# Altium project BW0253.PrjPcb (part 1 of 2)
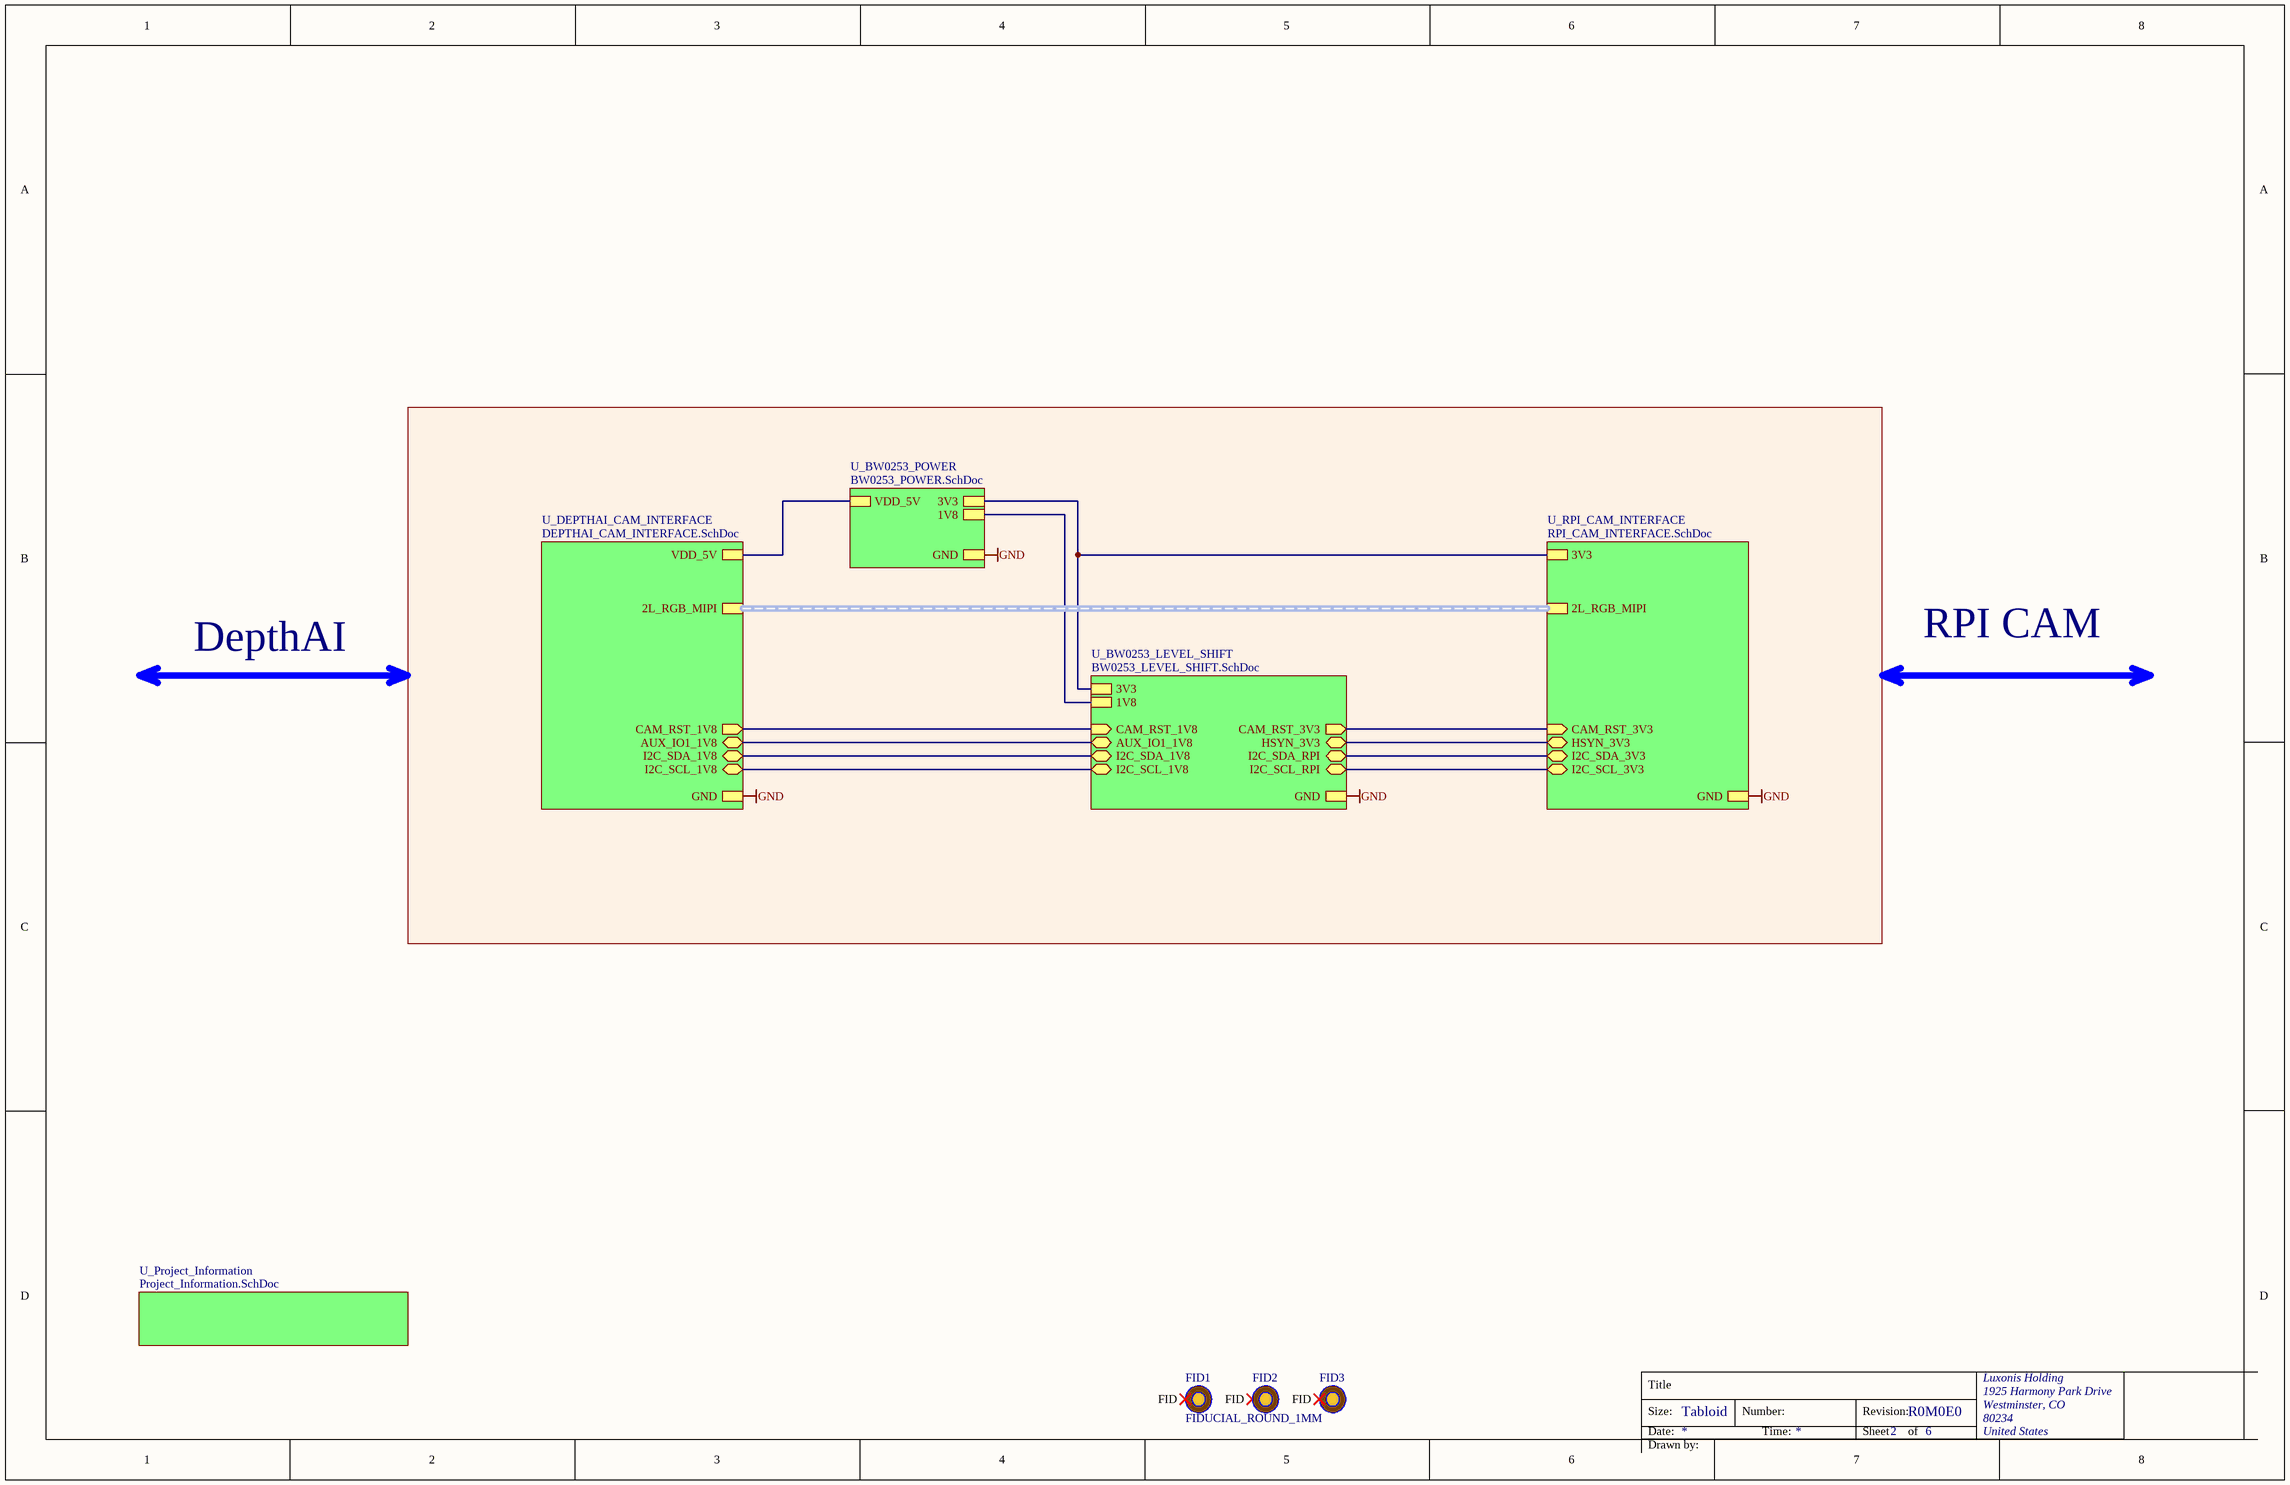
[diagram p0: TopLevel.SchDoc]
document_number: D0000999; drawn_by: Brian Weinstein; project_title: BW0253; revision: R0M0E0
6 sheets, 50 parts. Net scope: hierarchical (ports join the sheet entries above them; power ports are global).
Board file: BW0253.PcbDoc
Sheets:
  TopLevel.SchDoc
    U_Project_Information = Project_Information.SchDoc
    U_BW0253_POWER = BW0253_POWER.SchDoc
    U_BW0253_LEVEL_SHIFT = BW0253_LEVEL_SHIFT.SchDoc
    U_DEPTHAI_CAM_INTERFACE = DEPTHAI_CAM_INTERFACE.SchDoc
    U_RPI_CAM_INTERFACE = RPI_CAM_INTERFACE.SchDoc

## Sheet TopLevel.SchDoc: =project_title
size Tabloid; CompanyName: Luxonis Holding; DrawnBy: Brian Weinstein; Organization: Luxonis Holding; Address1: 1925 Harmony Park Drive; Address2: Westminster, CO; Address3: 80234; Address4: United States; DocumentNumber: D0000999; Revision: R0M0E0; SheetNumber: 2; SheetTotal: 6

### Parts
FID1  FIDUCIAL_ROUND_1MM  [FIDUCIAL_ROUND_1MM]  (no BOM)
FID2  FIDUCIAL_ROUND_1MM  [FIDUCIAL_ROUND_1MM]  (value not drawn)  (no BOM)
FID3  FIDUCIAL_ROUND_1MM  [FIDUCIAL_ROUND_1MM]  (value not drawn)  (no BOM)

### Sub-sheets
U_BW0253_LEVEL_SHIFT = BW0253_LEVEL_SHIFT.SchDoc: GND, 1V8, 3V3, I2C_SCL_RPI (bidir), I2C_SDA_1V8 (bidir), HSYN_3V3 (bidir), I2C_SDA_RPI (bidir), AUX_IO1_1V8 (bidir), CAM_RST_3V3 (out), I2C_SCL_1V8 (bidir), CAM_RST_1V8 (in)
U_BW0253_POWER = BW0253_POWER.SchDoc: 1V8, 3V3, VDD_5V, GND
U_DEPTHAI_CAM_INTERFACE = DEPTHAI_CAM_INTERFACE.SchDoc: 2L_RGB_MIPI (harness 2L_RGB_MIPI), VDD_5V, GND, AUX_IO1_1V8 (bidir), I2C_SDA_1V8 (bidir), CAM_RST_1V8 (out), I2C_SCL_1V8 (bidir)
U_Project_Information = Project_Information.SchDoc: no entries
U_RPI_CAM_INTERFACE = RPI_CAM_INTERFACE.SchDoc: 2L_RGB_MIPI (harness 2L_RGB_MIPI), GND, 3V3, CAM_RST_3V3 (in), HSYN_3V3 (bidir), I2C_SCL_3V3 (bidir), I2C_SDA_3V3 (bidir)

### Nets
1V8: sheet U_BW0253_POWER/1V8, sheet U_BW0253_LEVEL_SHIFT/1V8
3V3: sheet U_BW0253_POWER/3V3, sheet U_BW0253_LEVEL_SHIFT/3V3, sheet U_RPI_CAM_INTERFACE/3V3
GND: sheet U_BW0253_POWER/GND, sheet U_BW0253_LEVEL_SHIFT/GND, sheet U_DEPTHAI_CAM_INTERFACE/GND, sheet U_RPI_CAM_INTERFACE/GND
VDD_5V: sheet U_BW0253_POWER/VDD_5V, sheet U_DEPTHAI_CAM_INTERFACE/VDD_5V
AUX_IO1_1V8: sheet U_BW0253_LEVEL_SHIFT/AUX_IO1_1V8, sheet U_DEPTHAI_CAM_INTERFACE/AUX_IO1_1V8
CAM_RST_1V8: sheet U_BW0253_LEVEL_SHIFT/CAM_RST_1V8, sheet U_DEPTHAI_CAM_INTERFACE/CAM_RST_1V8
CAM_RST_3V3: sheet U_BW0253_LEVEL_SHIFT/CAM_RST_3V3, sheet U_RPI_CAM_INTERFACE/CAM_RST_3V3
HSYN_3V3: sheet U_BW0253_LEVEL_SHIFT/HSYN_3V3, sheet U_RPI_CAM_INTERFACE/HSYN_3V3
I2C_SCL_1V8: sheet U_BW0253_LEVEL_SHIFT/I2C_SCL_1V8, sheet U_DEPTHAI_CAM_INTERFACE/I2C_SCL_1V8
I2C_SCL_3V3: sheet U_BW0253_LEVEL_SHIFT/I2C_SCL_RPI, sheet U_RPI_CAM_INTERFACE/I2C_SCL_3V3
I2C_SDA_1V8: sheet U_BW0253_LEVEL_SHIFT/I2C_SDA_1V8, sheet U_DEPTHAI_CAM_INTERFACE/I2C_SDA_1V8
I2C_SDA_3V3: sheet U_BW0253_LEVEL_SHIFT/I2C_SDA_RPI, sheet U_RPI_CAM_INTERFACE/I2C_SDA_3V3

Not connected (* = marked no-connect by the designer): FID1 FID*; FID2 FID*; FID3 FID*

### Buses and harness runs
harness sheet U_DEPTHAI_CAM_INTERFACE/2L_RGB_MIPI = sheet U_RPI_CAM_INTERFACE/2L_RGB_MIPI

### Notes on the sheet
- DepthAI
- RPI CAM
- Title
- Size:
- Date:
- Tabloid
- Number:
- Time:
- Revision:
- Sheet
- of
- Drawn by:

### Library data of the parts
FID1-FID3 = FIDUCIAL: Fiducial with various available footprints

## Sheet Project_Information.SchDoc: =project_title
size Tabloid; CompanyName: Luxonis Holding; DrawnBy: Brian Weinstein; Organization: Luxonis Holding; Address1: 1925 Harmony Park Drive; Address2: Westminster, CO; Address3: 80234; Address4: United States; DocumentNumber: D0000999; Revision: R0M0E0; SheetNumber: 1; SheetTotal: 6
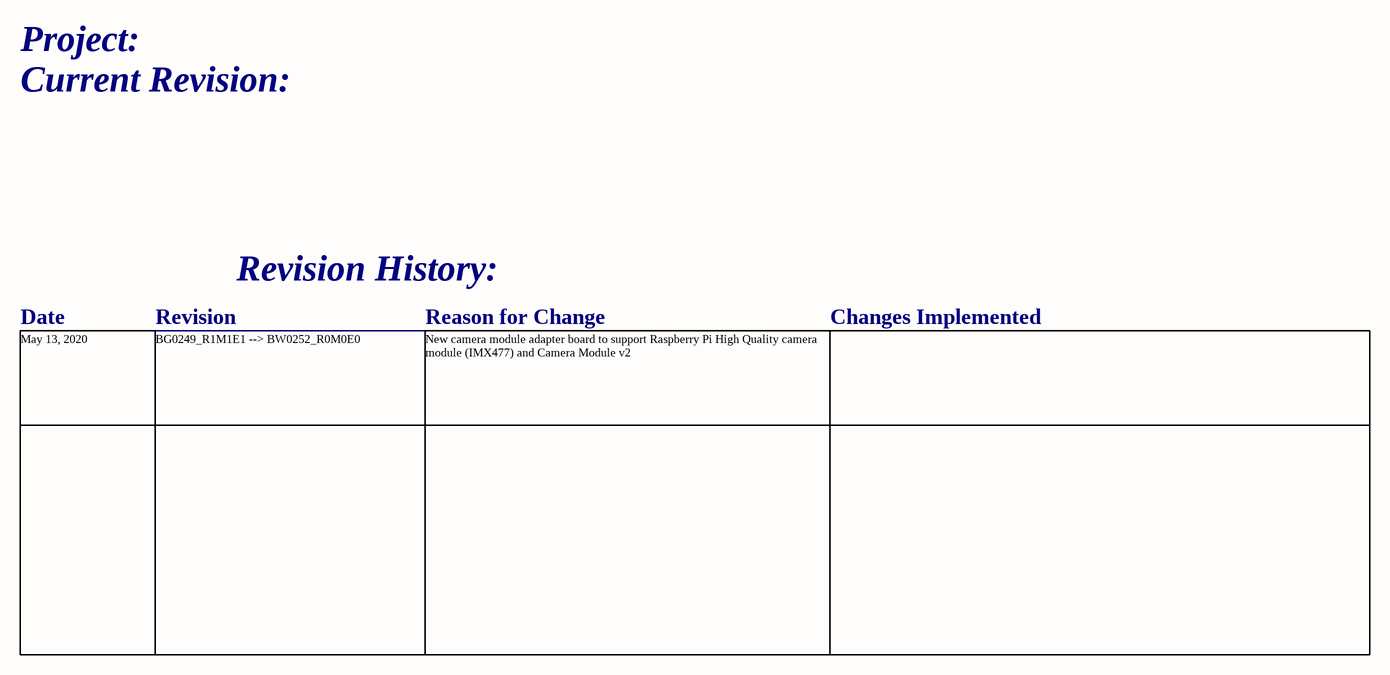
[diagram p1: Project_Information.SchDoc]

### Notes on the sheet
- Project:
- Current Revision:
- Revision History:
- Date
- Revision
- Reason for Change
- Changes Implemented
- May 13, 2020
- BG0249_R1M1E1 --> BW0252_R0M0E0
- New camera module adapter board to support Raspberry Pi High Quality camera module (IMX477) and Camera Module v2
- Title
- Size:
- Date:
- Tabloid
- Number:
- Time:
- Revision:
- Sheet
- of
- Drawn by:

## Sheet BW0253_POWER.SchDoc: =project_title
size Tabloid; CompanyName: Luxonis Holding; DrawnBy: Brian Weinstein; Organization: Luxonis Holding; Address1: 1925 Harmony Park Drive; Address2: Westminster, CO; Address3: 80234; Address4: United States; DocumentNumber: D0000999; Revision: R0M0E0; SheetNumber: 4; SheetTotal: 6
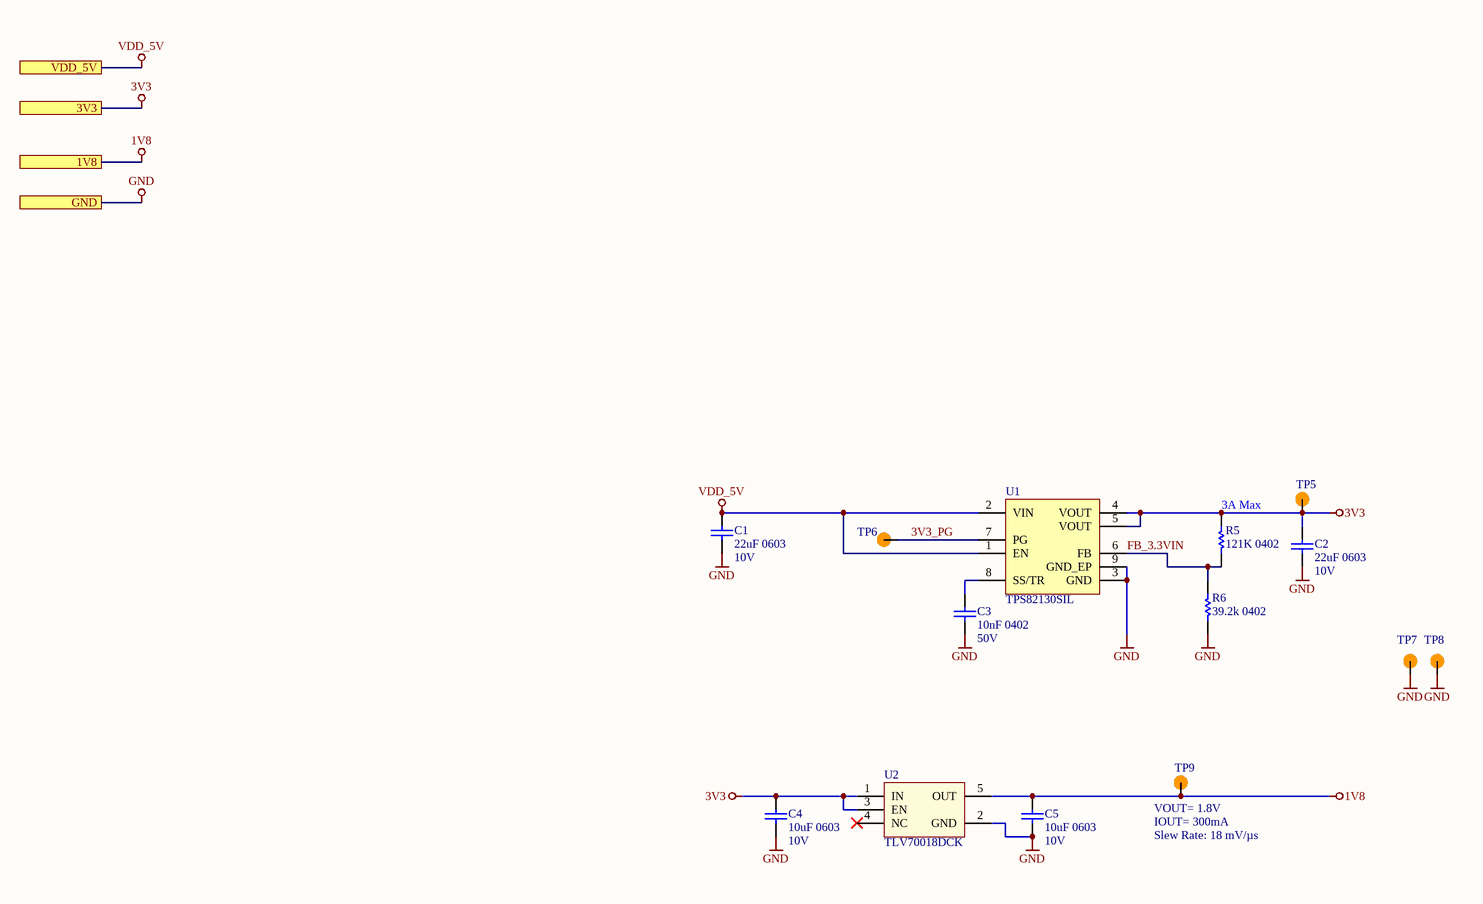
[diagram p2: BW0253_POWER.SchDoc]

### Parts
C1  22uF 0603  Voltage Rating: 10V  [CAPC0603(1608)100_N]
C2  22uF 0603  Voltage Rating: 10V  [CAPC0603(1608)100_N]
C3  10nF 0402  Voltage Rating: 50V  [CAPC0402(1005)60_N]
C4  10uF 0603  Voltage Rating: 10V  [CAPC0603(1608)100_N]
C5  10uF 0603  Voltage Rating: 10V  [CAPC0603(1608)100_N]
R5  121K 0402  [RESC0402(1005)_N]
R6  39.2k 0402  [RESC0402(1005)_N]
TP5  TP100_200_NS  [TP100_200_NS]  (value not drawn)  (no BOM)
TP6  TP100_200_NS  [TP100_200_NS]  (value not drawn)  (no BOM)
TP7  TP100_150_NS  [TP100_150_NS]  (value not drawn)  (no BOM)
TP8  TP100_150_NS  [TP100_150_NS]  (value not drawn)  (no BOM)
TP9  TP100_200_NS  [TP100_200_NS]  (value not drawn)  (no BOM)
U1  TPS82130SIL  [TPS82130SIL]
U2  TLV70018DCK  [TLV70018DCK]

### Ports
1V8, 3V3, GND, VDD_5V

### Nets
1V8: C5.2 TP9.1 U2.5(OUT) ; port 1V8
3V3: C2.1 C4.2 R5.1 TP5.1 U1.4(VOUT) U1.5(VOUT) U2.1(IN) U2.3(EN) ; port 3V3
GND: C1.1 C2.2 C3.1 C4.1 C5.1 R6.2 TP7.1 TP8.1 U1.3(GND) U1.9(GND_EP) U2.2(GND) ; port GND
VDD_5V: C1.2 U1.1(EN) U1.2(VIN) ; port VDD_5V
3V3_PG: TP6.1 U1.7(PG)
FB_3.3VIN: R5.2 R6.1 U1.6(FB)
NetC3_2: C3.2 U1.8(SS/TR)

Not connected (* = marked no-connect by the designer): U2 4(NC)*

### Notes on the sheet
- (near R5) 3A Max
- (near TP9) VOUT= 1.8V
- (near TP9) IOUT= 300mA
- (near TP9) Slew Rate: 18 mV/µs
- Title
- Size:
- Date:
- Tabloid
- Number:
- Time:
- Revision:
- Sheet
- of
- Drawn by:

### Library data of the parts
C1 C2 = GRM188R61A226ME15D: CAP CER 22UF 10V X5R 0603 20%; Manufacturer 1: Murata; Material: Ceramic; ComponentLink1URL: https://datasheet.ciiva.com/46444/1769893-46444975.pdf?src-supplier=Element14; ComponentLink1Description: https://datasheet.ciiva.com/46444/1769893-46444975.pdf?src-supplier=Element14; Supplier 1: Digi-Key; Manufacturer Part Number 1: GRM188R61A226ME15D; Stock 1: 984716; Pricing 1: 1=0.31000, 10=0.21500, 100=0.12160, 500=0.08584, 1000=0.07512 (USD); RoHS: Yes; Mount: Surface Mount; Case/Package: 0603; Weight: 0.000222oz; Case Code (Metric): 1608; Case Code (Imperial): 0603; Min Operating Temperature: -55°C; Max Operating Temperature: 85°C; Capacitance: 22uF; Tolerance: 20%; Packaging: Tape and Reel; Dielectric: X5R; Voltage Rating (DC): 10V; Termination: SMD/SMT; Package Quantity: 4000; Length: 1.6mm; Height: 0.8mm; Width: 0.8mm; Thickness: 0.039inch; Depth: 0.8mm; REACH SVHC: No SVHC; Lead Free: Lead Free; Supplier Part Number 1: 490-10476-1-ND
C3 = GRM155R71H103KA88D: CAP CER 10000PF 50V X7R 0402; Manufacturer 1: Murata; Material: Ceramic; Tolerance: 10%; Voltage: 25V; Supplier 1: Digi-Key; Manufacturer Part Number 1: GRM155R71H103KA88D; Stock 1: 6923572; Pricing 1: 1=0.10000, 10=0.03800, 100=0.01690, 500=0.01208, 1000=0.00949, 2500=0.00862, 5000=0.00794 (USD); RoHS: Yes; Mount: Surface Mount; Case/Package: 0402; Number of Pins: 2; Case Code (Metric): 1005; Case Code (Imperial): 0402; Min Operating Temperature: -55°C; Max Operating Temperature: 125°C; Capacitance: 10nF; Packaging: Tape and Reel; Termination: SMD/SMT; Voltage Rating (DC): 50V; Package Quantity: 1; Dielectric: X7R; Length: 1mm; Height: 0.5mm; Width: 0.02inch; Thickness: 0.022inch; Depth: 0.5mm; Radiation Hardening: No; REACH SVHC: No SVHC; Lead Free: Lead Free; ComponentLink1URL: https://datasheet.ciiva.com/129/product-129810.pdf?src-supplier=Digi-Key; ComponentLink1Description: https://datasheet.ciiva.com/129/product-129810.pdf?src-supplier=Digi-Key; ComponentLink2URL: https://datasheet.ciiva.com/19476/1856433-19476546.pdf?src-supplier=Jameco; ComponentLink2Description: https://datasheet.ciiva.com/19476/1856433-19476546.pdf?src-supplier=Jameco; ComponentLink3URL: https://datasheet.ciiva.com/11786/0900766b80ef921d-11786340.pdf?src-supplier=RSComponents; ComponentLink3Description: https://datasheet.ciiva.com/11786/0900766b80ef921d-11786340.pdf?src-supplier=RSComponents; ComponentLink4URL: https://datasheet.ciiva.com/18100/getdatasheetpartid-27434-18100660.pdf?src-supplier=Verical; ComponentLink4Description: https://datasheet.ciiva.com/18100/getdatasheetpartid-27434-18100660.pdf?src-supplier=Verical; ComponentLink5URL: https://datasheet.ciiva.com/22698/1747449-22698420.pdf?src-supplier=Element14; ComponentLink5Description: https://datasheet.ciiva.com/22698/1747449-22698420.pdf?src-supplier=Element14; ComponentLink6URL: https://datasheet.ciiva.com/29199/454225-da-01-en-vs-kondensator-0402-29199740.pdf?src-supplier=Conrad; ComponentLink6Description: https://datasheet.ciiva.com/29199/454225-da-01-en-vs-kondensator-0402-29199740.pdf?src-supplier=Conrad; ComponentLink7URL: https://datasheet.ciiva.com/129/grm155r71h103ka88-01-129811.pdf?src-supplier=Digi-Key; ComponentLink7Description: https://datasheet.ciiva.com/129/grm155r71h103ka88-01-129811.pdf?src-supplier=Digi-Key; ComponentLink8URL: https://datasheet.ciiva.com/129/grm155r71h103ka88-01-129812.pdf?src-supplier=Digi-Key; ComponentLink8Description: https://datasheet.ciiva.com/129/grm155r71h103ka88-01-129812.pdf?src-supplier=Digi-Key; ComponentLink9URL: https://datasheet.ciiva.com/16495/product-16495290.pdf?src-supplier=Future+Electronics; ComponentLink9Description: https://datasheet.ciiva.com/16495/product-16495290.pdf?src-supplier=Future+Electronics; ComponentLink10URL: https://datasheet.ciiva.com/5410/product-5410990.pdf?src-supplier=Mouser; ComponentLink10Description: https://datasheet.ciiva.com/5410/product-5410990.pdf?src-supplier=Mouser; Supplier 2: Mouser; Supplier 3: Arrow; Supplier Part Number 1: 490-4516-1-ND; Supplier Part Number 2: 81-GRM155R71H103KA8D; Supplier Part Number 3: GRM155R71H103KA88D
C4 C5 = GRM188R61A106ME69D: CAP CER 10UF 10V X5R 0603 20%; Manufacturer 1: Murata; Material: Ceramic; Supplier 1: Digi-Key; Manufacturer Part Number 1: GRM188R61A106ME69D; Stock 1: 2873098; Pricing 1: 1=0.21000, 10=0.14100, 100=0.07130, 500=0.04876, 1000=0.04313 (USD); RoHS: Yes; Mount: Surface Mount; Case/Package: 0603; Weight: 0.000222oz; Case Code (Metric): 1608; Case Code (Imperial): 0603; Min Operating Temperature: -55°C; Max Operating Temperature: 85°C; Packaging: Tape and Reel; Tolerance: 20%; Capacitance: 10uF; Dielectric: X5R; Voltage Rating (DC): 10V; Package Quantity: 4000; Termination: SMD/SMT; Length: 1.6mm; Height: 0.8mm; Width: 0.8mm; Thickness: 0.035inch; Depth: 0.8mm; REACH SVHC: Unknown; Lead Free: Lead Free; ComponentLink1URL: http://www.mouser.com/ds/2/281/c02e-2905.pdf?src-supplier=Mouser; ComponentLink1Description: http://www.mouser.com/ds/2/281/c02e-2905.pdf?src-supplier=Mouser; ComponentLink2URL: http://components.arrow.com/part/dataview/0323_06119472?src-supplier=Arrow+Europe; ComponentLink2Description: http://components.arrow.com/part/dataview/0323_06119472?src-supplier=Arrow+Europe; ComponentLink3URL: http://www.farnell.com/datasheets/2048014.pdf?src-supplier=Farnell; ComponentLink3Description: http://www.farnell.com/datasheets/2048014.pdf?src-supplier=Farnell; ComponentLink4URL: http://www.farnell.com/datasheets/1872210.pdf?src-supplier=Farnell; ComponentLink4Description: http://www.farnell.com/datasheets/1872210.pdf?src-supplier=Farnell; ComponentLink5URL: http://search.murata.co.jp/Ceramy/image/img/A01X/G101/ENG/GRM188R61A106ME69-01.pdf?src-supplier=Digi-Key; ComponentLink5Description: http://search.murata.co.jp/Ceramy/image/img/A01X/G101/ENG/GRM188R61A106ME69-01.pdf?src-supplier=Digi-Key; ComponentLink6URL: http://www.farnell.com/datasheets/1872210.pdf?src-supplier=Newark; ComponentLink6Description: http://www.farnell.com/datasheets/1872210.pdf?src-supplier=Newark; ComponentLink7URL: http://www.farnell.com/datasheets/2048014.pdf?src-supplier=Element14; ComponentLink7Description: http://www.farnell.com/datasheets/2048014.pdf?src-supplier=Element14; ComponentLink8URL: http://www.farnell.com/datasheets/2048014.pdf?src-supplier=Newark; ComponentLink8Description: http://www.farnell.com/datasheets/2048014.pdf?src-supplier=Newark; Supplier Part Number 1: 490-10475-1-ND
R5 = RC0402FR-07121KL: RES SMD 121K OHM 1% 1/16W 0402; Manufacturer 1: Yageo; Resistance: 121kR; Temperature Coefficient: 100ppm/°C; Power Rating: 62.5mW; Voltage Rating: 50V; Max Power Dissipation: 63mW; Supplier 1: Digi-Key; Manufacturer Part Number 1: RC0402FR-07121KL; Stock 1: 412120; Pricing 1: 1=0.10000, 10=0.01600, 100=0.00640, 1000=0.00289, 2500=0.00251, 5000=0.00207 (USD); RoHS: Yes; Case/Package: 0402; Case Code (Imperial): 0402; Case Code (Metric): 1005; Min Operating Temperature: -55°C; Max Operating Temperature: 155°C; Packaging: Tape and Reel; Tolerance: 1%; Package Quantity: 1; Composition: Thick Film; Termination: SMD/SMT; Number of Terminations: 2; Voltage Rating (DC): 50V; Features: Moisture Resistant; Military Standard: Not; Working Voltage: 50V; Length: 1mm; Height: 0.016inch; Width: 0.5mm; Depth: 0.5mm; Lead Free: Lead Free; REACH SVHC: No SVHC; ComponentLink1URL: https://datasheet.ciiva.com/2453/pyu-r-int-thick-7-2453445.pdf?src-supplier=Digi-Key; ComponentLink1Description: https://datasheet.ciiva.com/2453/pyu-r-int-thick-7-2453445.pdf?src-supplier=Digi-Key; ComponentLink2URL: https://datasheet.ciiva.com/2453/pyu-r-int-thick-7-2453446.pdf?src-supplier=Digi-Key; ComponentLink2Description: https://datasheet.ciiva.com/2453/pyu-r-int-thick-7-2453446.pdf?src-supplier=Digi-Key; ComponentLink3URL: https://datasheet.ciiva.com/2453/pyu-r-int-thick-7-2453447.pdf?src-supplier=Digi-Key; ComponentLink3Description: https://datasheet.ciiva.com/2453/pyu-r-int-thick-7-2453447.pdf?src-supplier=Digi-Key; Supplier 2: Newark; Supplier 3: Mouser; Supplier Part Number 1: 311-121KLRCT-ND; Supplier Part Number 3: 603-RC0402FR-07121KL; Supplier Part Number 2: 67R9895
R6 = CRCW040239K2FKED: RES SMD 39.2K OHM 1% 1/16W 0402; Manufacturer 1: Vishay; Resistance: 39.2kR; Temperature Coefficient: 100ppm/°C; Power Rating: 63mW; Voltage Rating: 50V; Supplier 1: Digi-Key; Manufacturer Part Number 1: CRCW040239K2FKED; Stock 1: 46258; Pricing 1: 1=0.10000, 10=0.03800, 100=0.01540, 1000=0.00690, 2500=0.00599, 5000=0.00495 (USD); RoHS: Yes; Case/Package: 0402; Number of Pins: 2; Weight: 2.3E-05oz; Case Code (Imperial): 0402; Case Code (Metric): 1005; Contact Plating: Tin; Min Operating Temperature: -55°C; Max Operating Temperature: 155°C; Tolerance: 1%; Packaging: Tape and Reel; Composition: Thick Film; Number of Terminations: 2; Voltage Rating (DC): 50V; Termination: SMD/SMT; Max Power Dissipation: 63mW; Package Quantity: 10; Military Standard: Not; Features: Automotive AEC-Q200; Length: 1mm; Height: 0.35mm; Width: 0.5mm; Depth: 0.5mm; Radiation Hardening: No; Lead Free: Lead Free; REACH SVHC: Unknown; ComponentLink1URL: https://datasheet.ciiva.com/11818/0900766b80d98824-11818068.pdf?src-supplier=RSComponents; ComponentLink1Description: https://datasheet.ciiva.com/11818/0900766b80d98824-11818068.pdf?src-supplier=RSComponents; ComponentLink2URL: https://datasheet.ciiva.com/16882/dcrcwe3-16882152.pdf?src-supplier=Avnet+Europe; ComponentLink2Description: https://datasheet.ciiva.com/16882/dcrcwe3-16882152.pdf?src-supplier=Avnet+Europe; ComponentLink3URL: https://datasheet.ciiva.com/2463/dcrcwe3-2463561.pdf?src-supplier=Digi-Key; ComponentLink3Description: https://datasheet.ciiva.com/2463/dcrcwe3-2463561.pdf?src-supplier=Digi-Key; ComponentLink4URL: https://datasheet.ciiva.com/3256/dcrcwe3-3256469.pdf?src-supplier=Avnet; ComponentLink4Description: https://datasheet.ciiva.com/3256/dcrcwe3-3256469.pdf?src-supplier=Avnet; ComponentLink5URL: https://datasheet.ciiva.com/2463/dcrcwe3-2463559.pdf?src-supplier=Digi-Key; ComponentLink5Description: https://datasheet.ciiva.com/2463/dcrcwe3-2463559.pdf?src-supplier=Digi-Key; ComponentLink6URL: https://datasheet.ciiva.com/2463/dcrcwe3-2463560.pdf?src-supplier=Digi-Key; ComponentLink6Description: https://datasheet.ciiva.com/2463/dcrcwe3-2463560.pdf?src-supplier=Digi-Key; ComponentLink7URL: https://datasheet.ciiva.com/16774/70201119-16774809.pdf?src-supplier=Allied+Electronics; ComponentLink7Description: https://datasheet.ciiva.com/16774/70201119-16774809.pdf?src-supplier=Allied+Electronics; ComponentLink8URL: https://datasheet.ciiva.com/22869/70201119-22869593.pdf?src-supplier=Allied+Electronics; ComponentLink8Description: https://datasheet.ciiva.com/22869/70201119-22869593.pdf?src-supplier=Allied+Electronics; ComponentLink9URL: https://datasheet.ciiva.com/16429/dcrcwe3-16429962.pdf?src-supplier=Future+Electronics; ComponentLink9Description: https://datasheet.ciiva.com/16429/dcrcwe3-16429962.pdf?src-supplier=Future+Electronics; ComponentLink10URL: https://datasheet.ciiva.com/7671/1697337-7671596.pdf?src-supplier=Element14; ComponentLink10Description: https://datasheet.ciiva.com/7671/1697337-7671596.pdf?src-supplier=Element14; ComponentLink11URL: https://datasheet.ciiva.com/7671/1533075-7671772.pdf?src-supplier=Element14; ComponentLink11Description: https://datasheet.ciiva.com/7671/1533075-7671772.pdf?src-supplier=Element14; Supplier Part Number 1: 541-39.2KLCT-ND
TP5-TP9 = TEST_POINT
U1 = TPS82130SIL: DC DC CONVERTER 0.9-5V; Manufacturer 1: Texas Instruments; Manufacturer Part Number 1: TPS82130SILR; Number of Outputs: 1; Min Input Voltage: 3V; Max Input Voltage: 17V; Voltage - Output 1: 5V; Max Output Current: 3A; Quiescent Current: 20uA; Supplier 1: Mouser; RoHS: Yes; Category: Voltage Regulators - Switching; Stock 1: 83975; Pricing 1: 1=3.82000, 10=3.43000, 100=2.81000, 250=2.64000, 500=2.39000, 1000=2.02000 (USD); Mount: Surface Mount; Case/Package: SMD/SMT; Min Operating Temperature: -40°C; Max Operating Temperature: 125°C; Packaging: Tape and Reel; Features: OTP; Length: 0.12inch; Height: 0.06inch; Width: 0.11inch; Lead Free: Lead Free; ComponentLink1URL: http://www.ti.com/lit/ds/symlink/tps82130.pdf?src-supplier=Digi-Key; ComponentLink1Description: http://www.ti.com/lit/ds/symlink/tps82130.pdf?src-supplier=Digi-Key; ComponentLink2URL: http://www.ti.com/lit/ds/symlink/tps82130.pdf?src-supplier=Newark; ComponentLink2Description: http://www.ti.com/lit/ds/symlink/tps82130.pdf?src-supplier=Newark; ComponentLink3URL: http://www.ti.com/lit/gpn/tps82130?src-supplier=Mouser; ComponentLink3Description: http://www.ti.com/lit/gpn/tps82130?src-supplier=Mouser; Supplier 2: Newark; Supplier Part Number 1: 595-TPS82130SILR; Supplier Part Number 2: 33AH5407; Supplier 3: Digi-Key; Supplier Part Number 3: 296-43922-1-ND
U2 = TLV70018DCK: IC REG LINEAR 1.8V 200MA SC70-5 Linear Voltage Regulator IC  1 Output  200mA SC-70-5; Manufacturer 1: Texas Instruments; Manufacturer Part Number 1: TLV70018DCKR; Max Power Dissipation: 320mW; Number of Outputs: 1; Dropout Voltage: 175mV; Max Input Voltage: 5.5V; Min Input Voltage: 2V; Min Current Limit: 220mA; Polarity: Positive; Output Voltage Accuracy: 2%; Quiescent Current: 30uA; Output Type: Fixed; Nominal Supply Current: 31uA; Supplier 1: Digi-Key; Stock 1: 63905; Pricing 1: 1=0.48000, 10=0.40900, 100=0.30570, 500=0.24020, 1000=0.18561 (USD); RoHS: Yes; Case/Package: SC; Number of Pins: 5; Contact Plating: Gold; Min Operating Temperature: -40°C; Max Operating Temperature: 125°C; Packaging: Tape and Reel; Package Quantity: 1; Output Voltage: 1.8V; Output Current: 200mA; Max Output Current: 200mA; Number of Regulators: 1; Power Dissipation: 320mW; Nominal Output Voltage: 1.8V; Accuracy: 2%; Max Output Voltage: 1.8V; Min Output Voltage: 1.8V; REACH SVHC: No SVHC; Lead Free: Lead Free; ComponentLink1URL: https://datasheet.ciiva.com/41462/001014631-da-01-en-ic-reg-ldo-1-8v-0-tlv70018dckr-sot-5-tid-41462480.pdf?src-supplier=Conrad; ComponentLink1Description: https://datasheet.ciiva.com/41462/001014631-da-01-en-ic-reg-ldo-1-8v-0-tlv70018dckr-sot-5-tid-41462480.pdf?src-supplier=Conrad; Supplier 2: Digi-Key; Manufacturer 2: Texas Instruments; Manufacturer Part Number 2: TLV70018DCKT; Stock 2: 13188; Pricing 2: 1=0.55000, 10=0.46700, 100=0.34900 (USD); Power Rating: 320mW; Length: 2.15mm; Height: 1mm; Width: 1.4mm; Radiation Hardening: No; ComponentLink2URL: https://datasheet.ciiva.com/22700/1882059-22700171.pdf?src-supplier=Element14; ComponentLink2Description: https://datasheet.ciiva.com/22700/1882059-22700171.pdf?src-supplier=Element14; ComponentLink3URL: https://datasheet.ciiva.com/14149/tlv700-eng-ds-14149837.pdf?src-supplier=Distrelec; ComponentLink3Description: https://datasheet.ciiva.com/14149/tlv700-eng-ds-14149837.pdf?src-supplier=Distrelec; ComponentLink4URL: https://datasheet.ciiva.com/7992/1882059-7992894.pdf?src-supplier=Element14; ComponentLink4Description: https://datasheet.ciiva.com/7992/1882059-7992894.pdf?src-supplier=Element14; Supplier Part Number 1: 296-32409-1-ND; Supplier Part Number 2: 296-25269-1-ND

## Sheet BW0253_LEVEL_SHIFT.SchDoc: =project_title
size Tabloid; CompanyName: Luxonis Holding; DrawnBy: Brian Weinstein; Organization: Luxonis Holding; Address1: 1925 Harmony Park Drive; Address2: Westminster, CO; Address3: 80234; Address4: United States; DocumentNumber: D0000999; Revision: R0M0E0; SheetNumber: 5; SheetTotal: 6
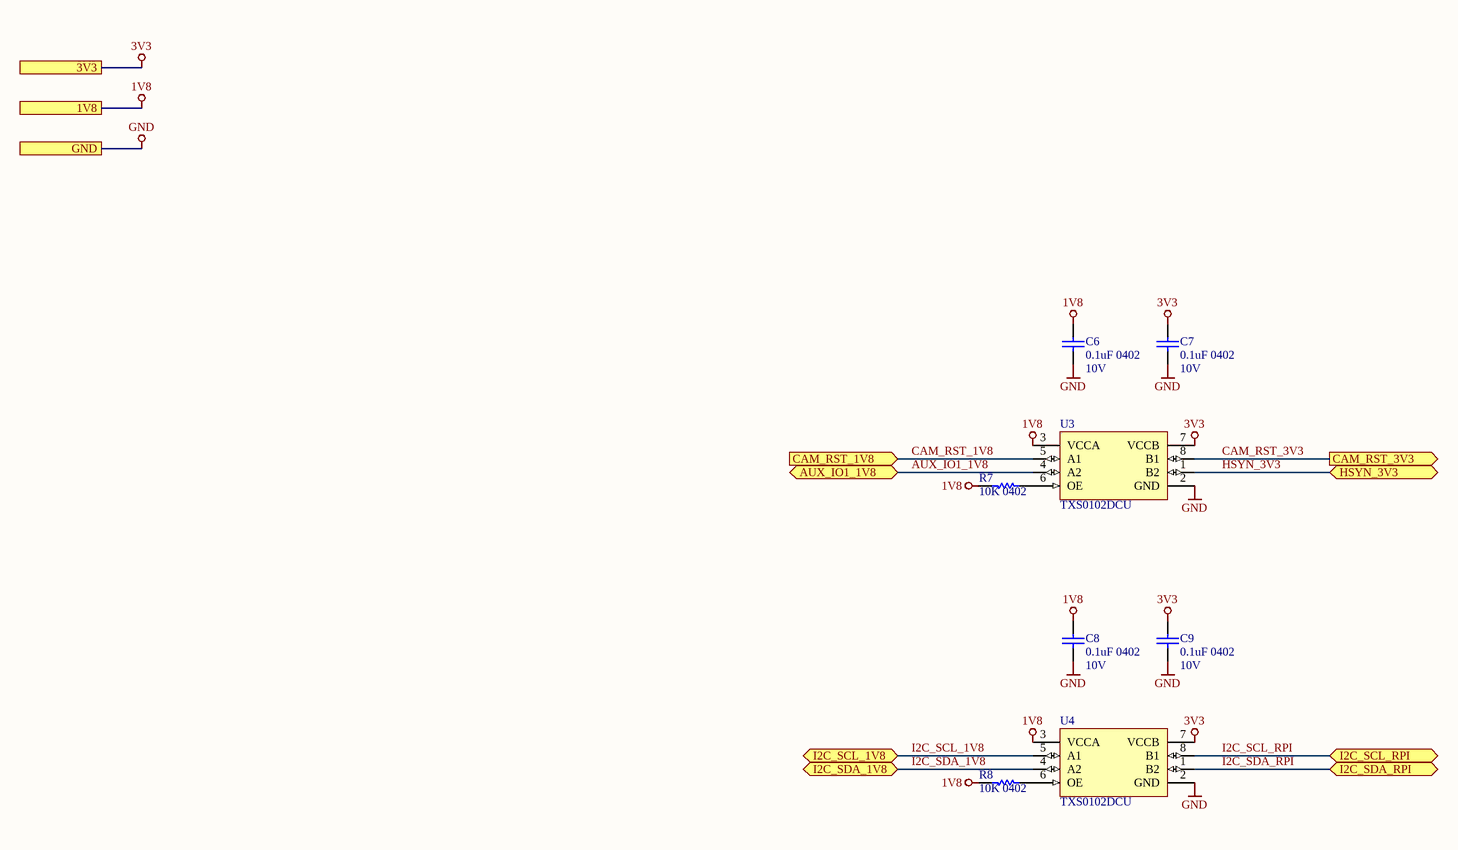
[diagram p3: BW0253_LEVEL_SHIFT.SchDoc]

### Parts
C6  0.1uF 0402  Voltage Rating: 10V  [CAPC0402(1005)70_N]
C7  0.1uF 0402  Voltage Rating: 10V  [CAPC0402(1005)70_N]
C8  0.1uF 0402  Voltage Rating: 10V  [CAPC0402(1005)70_N]
C9  0.1uF 0402  Voltage Rating: 10V  [CAPC0402(1005)70_N]
R7  10K 0402  [RESC0402(1005)_N]
R8  10K 0402  [RESC0402(1005)_N]
U3  TXS0102DCU  [TXS0102DCUR]
U4  TXS0102DCU  [TXS0102DCUR]

### Ports
1V8, 3V3, AUX_IO1_1V8 (bidir), CAM_RST_1V8 (in), CAM_RST_3V3 (out), GND, HSYN_3V3 (bidir), I2C_SCL_1V8 (bidir), I2C_SCL_RPI (bidir), I2C_SDA_1V8 (bidir), I2C_SDA_RPI (bidir)

### Nets
1V8: C6.2 C8.2 R7.2 R8.2 U3.3(VCCA) U4.3(VCCA) ; port 1V8
3V3: C7.2 C9.2 U3.7(VCCB) U4.7(VCCB) ; port 3V3
GND: C6.1 C7.1 C8.1 C9.1 U3.2(GND) U4.2(GND) ; port GND
AUX_IO1_1V8: U3.4(A2) ; port AUX_IO1_1V8
CAM_RST_1V8: U3.5(A1) ; port CAM_RST_1V8
CAM_RST_3V3: U3.8(B1) ; port CAM_RST_3V3
HSYN_3V3: U3.1(B2) ; port HSYN_3V3
I2C_SCL_1V8: U4.5(A1) ; port I2C_SCL_1V8
I2C_SCL_RPI: U4.8(B1) ; port I2C_SCL_RPI  [project net I2C_SCL_3V3]
I2C_SDA_1V8: U4.4(A2) ; port I2C_SDA_1V8
I2C_SDA_RPI: U4.1(B2) ; port I2C_SDA_RPI  [project net I2C_SDA_3V3]
NetR7_1: R7.1 U3.6(OE)
NetR8_1: R8.1 U4.6(OE)

### Notes on the sheet
- Title
- Size:
- Date:
- Tabloid
- Number:
- Time:
- Revision:
- Sheet
- of
- Drawn by:

### Library data of the parts
C6-C9 = GRM155R71A104JA01D: CAP CER 0.1UF 10V X7R 0402 5%; Manufacturer 1: Murata; Capacitance: 100nF; Supplier 1: Digi-Key; Manufacturer Part Number 1: GRM155R71A104JA01D; Stock 1: 1346709; Pricing 1: 1=0.10000, 10=0.02500, 100=0.01130, 500=0.00806, 1000=0.00633, 2500=0.00575, 5000=0.00529 (USD); RoHS: Yes; Mount: Surface Mount; Case/Package: 0402; Case Code (Imperial): 0402; Case Code (Metric): 1005; Min Operating Temperature: -55°C; Max Operating Temperature: 125°C; Tolerance: 5%; Packaging: Tape and Reel; Voltage Rating (DC): 10V; Dielectric: X7R; Package Quantity: 10000; Termination: SMD/SMT; Length: 1mm; Height: 0.5mm; Width: 0.02inch; Thickness: 0.022inch; Depth: 0.5mm; Radiation Hardening: No; Lead Free: Lead Free; ComponentLink1URL: https://datasheet.ciiva.com/5411/product-5411135.pdf?src-supplier=Mouser; ComponentLink1Description: https://datasheet.ciiva.com/5411/product-5411135.pdf?src-supplier=Mouser; ComponentLink2URL: https://datasheet.ciiva.com/11618/c02e-11618821.pdf?src-supplier=Avnet; ComponentLink2Description: https://datasheet.ciiva.com/11618/c02e-11618821.pdf?src-supplier=Avnet; Supplier Part Number 1: 490-10777-1-ND
R7 R8 = RC0402FR-1310KL: RES SMD 10K OHM 1% 0402 1/16W Chip Resistor, 0402 [1005 Metric], 10 kohm, RC Series, 50 V, Thick Film, 62.5 mW; Manufacturer 1: Yageo; Resistance: 10kR; Temperature Coefficient: 100ppm/°C; Power Rating: 62.5mW; Voltage Rating: 50V; ComponentLink1URL: https://datasheet.ciiva.com/16940/pyu-rc0402-51-rohs-l-6-16940293.pdf?src-supplier=Avnet+Europe; ComponentLink1Description: https://datasheet.ciiva.com/16940/pyu-rc0402-51-rohs-l-6-16940293.pdf?src-supplier=Avnet+Europe; ComponentLink2URL: https://datasheet.ciiva.com/28386/pyu-rc0402-51-rohs-l-6-28386855.pdf?src-supplier=Avnet+Europe; ComponentLink2Description: https://datasheet.ciiva.com/28386/pyu-rc0402-51-rohs-l-6-28386855.pdf?src-supplier=Avnet+Europe; ComponentLink3URL: https://datasheet.ciiva.com/16740/pyu-rc0402-51-rohs-l-6-r-16740602.pdf?src-supplier=Future+Electronics; ComponentLink3Description: https://datasheet.ciiva.com/16740/pyu-rc0402-51-rohs-l-6-r-16740602.pdf?src-supplier=Future+Electronics; ComponentLink4URL: https://datasheet.ciiva.com/8891/pyu-rc0402-51-rohs-l-6-8891339.pdf?src-supplier=Avnet; ComponentLink4Description: https://datasheet.ciiva.com/8891/pyu-rc0402-51-rohs-l-6-8891339.pdf?src-supplier=Avnet; ComponentLink5URL: https://datasheet.ciiva.com/5557/pyu-rc0402-51-rohs-l-6-r-5557997.pdf?src-supplier=Mouser; ComponentLink5Description: https://datasheet.ciiva.com/5557/pyu-rc0402-51-rohs-l-6-r-5557997.pdf?src-supplier=Mouser; ComponentLink6URL: https://datasheet.ciiva.com/7983/1018594-7983533.pdf?src-supplier=Element14; ComponentLink6Description: https://datasheet.ciiva.com/7983/1018594-7983533.pdf?src-supplier=Element14; Supplier 1: Newark; Manufacturer Part Number 1: RC0402FR-1310KL; Stock 1: 62239; Pricing 1: 1=0.10000, 25=0.01200, 100=0.00400, 250=0.00400, 500=0.00300, 1000=0.00300 (USD); RoHS: Yes; Case/Package: 0402; Number of Pins: 2; Contact Plating: Tin,Matte,Lead; Case Code (Imperial): 0402; Case Code (Metric): 1005; Min Operating Temperature: -55°C; Max Operating Temperature: 155°C; Tolerance: 1%; Composition: Thick Film; Packaging: Tape and Reel; Termination: SMD/SMT; Military Standard: Not; Voltage Rating (DC): 50V; Working Voltage: 50V; Number of Terminations: 2; Length: 1mm; Depth: 0.5mm; Radiation Hardening: No; REACH SVHC: No SVHC; Lead Free: Lead Free; Supplier Part Number 1: 67R9960; Supplier 2: Future Electronics; Supplier 3: Mouser; Supplier 4: Element14; Supplier Part Number 2: RC0402FR-1310KL-CUTT; Supplier Part Number 3: 603-RC0402FR-1310KL; Supplier Part Number 4: 1799235
U3 U4 = TXS0102DCUR: TEXAS INSTRUMENTS - TXS0102DCUR - IC, TRANSLATOR, 2 BIT, BI, US-8; Min Supply Voltage: 1.65V; Max Supply Voltage: 5.5V; Data Rate: 24Mbps; Number of Channels: 2; Propagation Delay: 4.6ns; Turn-On Delay Time: 260ns; High Level Output Current: -20uA; Low Level Output Current: 1mA; Quiescent Current: 14.4uA; Output Type: Voltage; Output Current: 1A; Supplier 1: Digi-Key; Manufacturer 1: Texas Instruments; Manufacturer Part Number 1: TXS0102DCUR; RoHS: Yes; Category: Logic Gates; Stock 1: 55123; Pricing 1: 1=0.75000, 10=0.65900, 25=0.61960, 100=0.50550, 250=0.46956, 500=0.39964, 1000=0.31971 (USD); Case/Package: VSSOP; Number of Pins: 8; Weight: 0.000339oz; Min Operating Temperature: -40°C; Max Operating Temperature: 85°C; Package Quantity: 1; Packaging: Tape and Reel; Logic Function: Translator; Number of Bits: 2; Number of Inputs: 2; Nominal Supply Current: 14.4uA; Radiation Hardening: No; Lead Free: Lead Free; REACH SVHC: No SVHC; ComponentLink1URL: https://datasheet.ciiva.com/15096/getdatasheetpartid-118249-15096172.pdf?src-supplier=Verical; ComponentLink1Description: https://datasheet.ciiva.com/15096/getdatasheetpartid-118249-15096172.pdf?src-supplier=Verical; ComponentLink2URL: https://datasheet.ciiva.com/22653/1846850-22653373.pdf?src-supplier=Farnell; ComponentLink2Description: https://datasheet.ciiva.com/22653/1846850-22653373.pdf?src-supplier=Farnell; ComponentLink3URL: https://datasheet.ciiva.com/1508/1857232-1508821.pdf?src-supplier=Element14; ComponentLink3Description: https://datasheet.ciiva.com/1508/1857232-1508821.pdf?src-supplier=Element14; ComponentLink4URL: https://datasheet.ciiva.com/1899/txs0102-1899368.pdf?src-supplier=Digi-Key; ComponentLink4Description: https://datasheet.ciiva.com/1899/txs0102-1899368.pdf?src-supplier=Digi-Key; ComponentLink5URL: https://datasheet.ciiva.com/1899/txs0102-1899369.pdf?src-supplier=Digi-Key; ComponentLink5Description: https://datasheet.ciiva.com/1899/txs0102-1899369.pdf?src-supplier=Digi-Key; ComponentLink6URL: https://datasheet.ciiva.com/1899/txs0102-1899370.pdf?src-supplier=Digi-Key; ComponentLink6Description: https://datasheet.ciiva.com/1899/txs0102-1899370.pdf?src-supplier=Digi-Key; ComponentLink7URL: https://datasheet.ciiva.com/14287/txs0102-14287516.pdf?src-supplier=Avnet; ComponentLink7Description: https://datasheet.ciiva.com/14287/txs0102-14287516.pdf?src-supplier=Avnet; ComponentLink8URL: https://datasheet.ciiva.com/28499/1863639-28499676.pdf?src-supplier=Element14; ComponentLink8Description: https://datasheet.ciiva.com/28499/1863639-28499676.pdf?src-supplier=Element14; ComponentLink9URL: https://datasheet.ciiva.com/14287/txs0102-14287518.pdf?src-supplier=Avnet; ComponentLink9Description: https://datasheet.ciiva.com/14287/txs0102-14287518.pdf?src-supplier=Avnet; ComponentLink10URL: https://datasheet.ciiva.com/46395/1863639-46395871.pdf?src-supplier=Element14; ComponentLink10Description: https://datasheet.ciiva.com/46395/1863639-46395871.pdf?src-supplier=Element14; Supplier 2: Newark; Supplier 3: Mouser; Supplier Part Number 1: 296-21931-1-ND; Supplier Part Number 2: 30M1878; Supplier Part Number 3: 595-TXS0102DCUR

## Sheet DEPTHAI_CAM_INTERFACE.SchDoc: =project_title
size Tabloid; CompanyName: Luxonis Holding; DrawnBy: Brian Weinstein; Organization: Luxonis Holding; Address1: 1925 Harmony Park Drive; Address2: Westminster, CO; Address3: 80234; Address4: United States; DocumentNumber: D0000999; Revision: R0M0E0; SheetNumber: 6; SheetTotal: 6
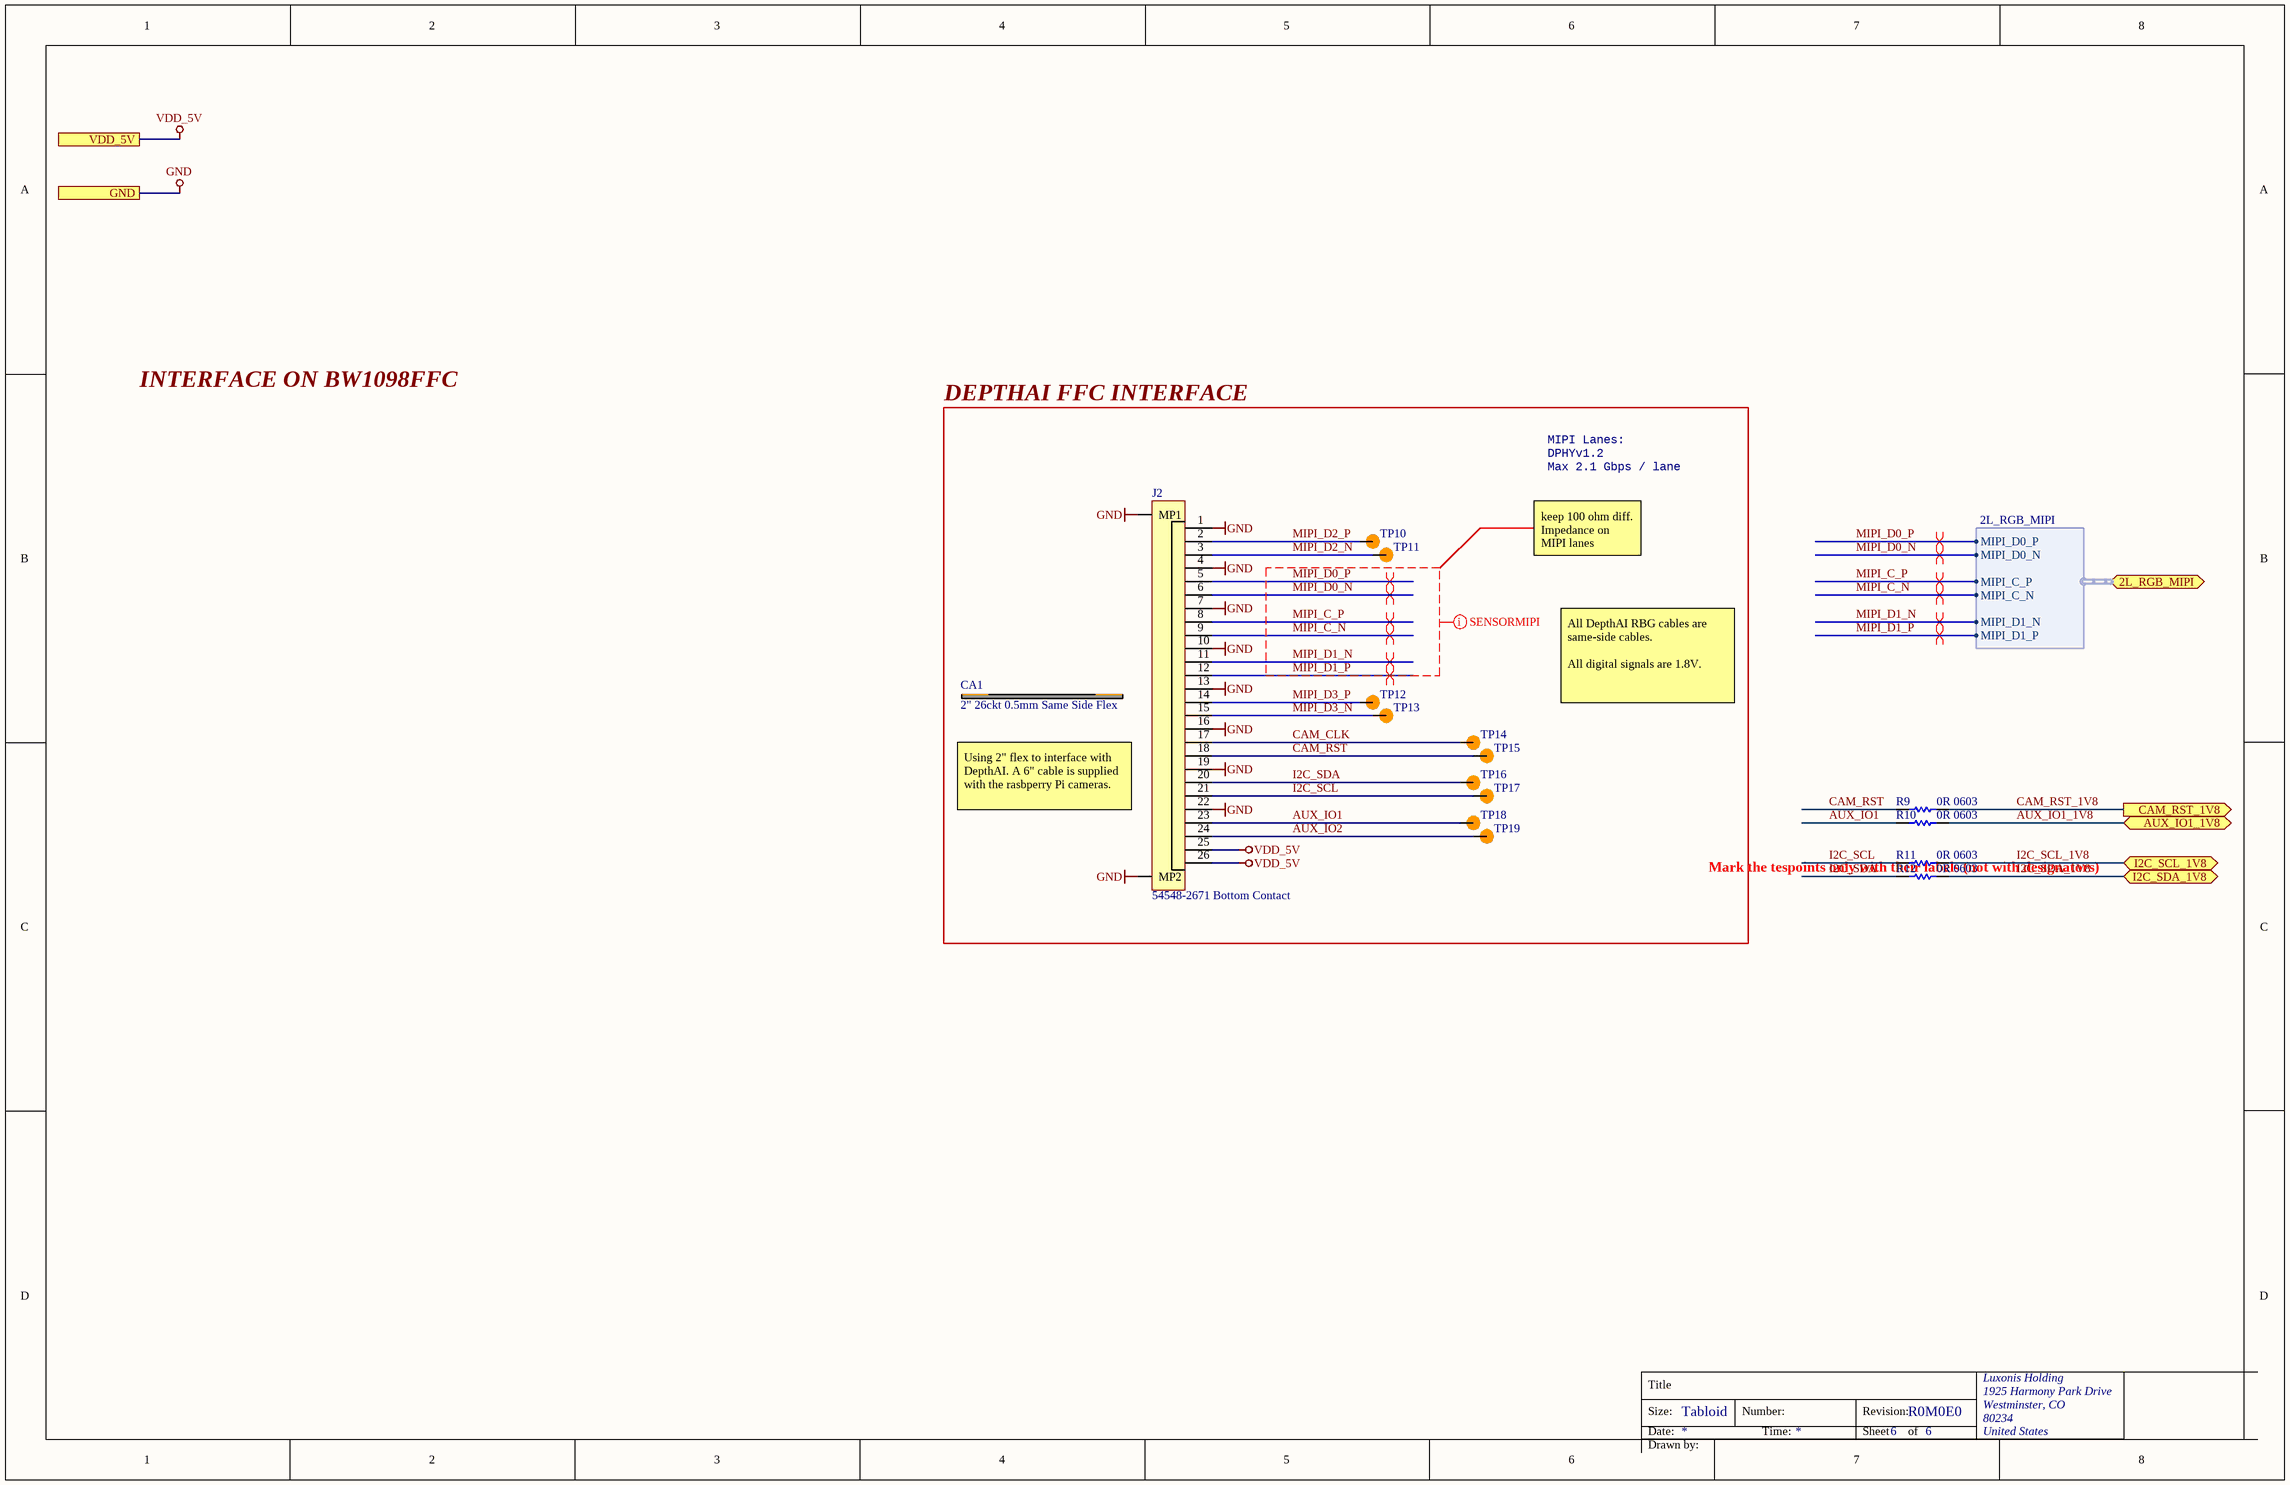
[diagram p4: DEPTHAI_CAM_INTERFACE.SchDoc]

### Parts
CA1  2" 26ckt 0.5mm Same Side Flex
J2  54548-2671 Bottom Contact  [54548-2671]
R9  0R 0603  [RESC0603(1608)_M]
R10  0R 0603  [RESC0603(1608)_M]
R11  0R 0603  [RESC0603(1608)_M]
R12  0R 0603  [RESC0603(1608)_M]
TP10  TP075_150_NS  [TP075_150_NS]  (value not drawn)  (no BOM)
TP11  TP075_150_NS  [TP075_150_NS]  (value not drawn)  (no BOM)
TP12  TP075_150_NS  [TP075_150_NS]  (value not drawn)  (no BOM)
TP13  TP075_150_NS  [TP075_150_NS]  (value not drawn)  (no BOM)
TP14  TP100_150_NS  [TP100_150_NS]  (value not drawn)  (no BOM)
TP15  TP100_150_NS  [TP100_150_NS]  (value not drawn)  (no BOM)
TP16  TP100_150_NS  [TP100_150_NS]  (value not drawn)  (no BOM)
TP17  TP100_150_NS  [TP100_150_NS]  (value not drawn)  (no BOM)
TP18  TP100_150_NS  [TP100_150_NS]  (value not drawn)  (no BOM)
TP19  TP100_150_NS  [TP100_150_NS]  (value not drawn)  (no BOM)

### Blocks framed on the sheet
DEPTHAI FFC INTERFACE: CA1 J2 TP10-TP19

### Ports
2L_RGB_MIPI (bidir, harness 2L_RGB_MIPI), AUX_IO1_1V8 (bidir), CAM_RST_1V8 (out), GND, I2C_SCL_1V8 (bidir), I2C_SDA_1V8 (bidir), VDD_5V

### Harnesses
2L_RGB_MIPI: MIPI_D0_P, MIPI_D0_N, MIPI_C_P, MIPI_C_N, MIPI_D1_N, MIPI_D1_P

### Nets
GND: J2.1 J2.4 J2.7 J2.10 J2.13 J2.16 J2.19 J2.22 J2.MP1 J2.MP2 ; port GND
VDD_5V: J2.25 J2.26 ; port VDD_5V
AUX_IO1: J2.23 R10.1 TP18.1
AUX_IO1_1V8: R10.2 ; port AUX_IO1_1V8
AUX_IO2: J2.24 TP19.1
CAM_CLK: J2.17 TP14.1
CAM_RST: J2.18 R9.1 TP15.1
CAM_RST_1V8: R9.2 ; port CAM_RST_1V8
I2C_SCL: J2.21 R11.1 TP17.1
I2C_SCL_1V8: R11.2 ; port I2C_SCL_1V8
I2C_SDA: J2.20 R12.1 TP16.1
I2C_SDA_1V8: R12.2 ; port I2C_SDA_1V8
MIPI_C_N: J2.9 ; port 2L_RGB_MIPI.MIPI_C_N
MIPI_C_P: J2.8 ; port 2L_RGB_MIPI.MIPI_C_P
MIPI_D0_N: J2.6 ; port 2L_RGB_MIPI.MIPI_D0_N
MIPI_D0_P: J2.5 ; port 2L_RGB_MIPI.MIPI_D0_P
MIPI_D1_N: J2.11 ; port 2L_RGB_MIPI.MIPI_D1_N
MIPI_D1_P: J2.12 ; port 2L_RGB_MIPI.MIPI_D1_P
MIPI_D2_N: J2.3 TP11.1
MIPI_D2_P: J2.2 TP10.1
MIPI_D3_N: J2.15 TP13.1
MIPI_D3_P: J2.14 TP12.1

### Layout directives
net class SENSORMIPI: MIPI_C_N, MIPI_C_P, MIPI_D0_N, MIPI_D0_P, MIPI_D1_N, MIPI_D1_P
differential pair: MIPI_C_N, MIPI_C_P, MIPI_D0_N, MIPI_D0_P, MIPI_D1_N, MIPI_D1_P

### Notes on the sheet
- INTERFACE ON BW1098FFC
- MIPI Lanes:
- Max 2.1 Gbps / lane
- DPHYv1.2
- keep 100 ohm diff. Impedance on MIPI lanes
- All DepthAI RBG cables are same-side cables.
  All digital signals are 1.8V.
- (near J2) Using 2" flex to interface with DepthAI. A 6" cable is supplied with the rasbperry Pi cameras.
- Mark the tespoints only with their labels (not with designators)
- Title
- Size:
- Date:
- Tabloid
- Number:
- Time:
- Revision:
- Sheet
- of
- Drawn by:

### Library data of the parts
CA1 = 0151660273: FFC 0.50 TYPE A 26 CKTS LGT 51; Manufacturer 1: Molex; Number of Conductors: 26; Wire/Cable Type: Flat Flex; Pitch: 0.02inch; Supplier 1: Digi-Key; Manufacturer Part Number 1: 0151660273; Stock 1: 738; Pricing 1: 1=2.00000, 10=1.81500, 25=1.70400, 50=1.63000, 100=1.55590, 250=1.40772, 500=1.29658, 1000=1.11135, 2500=1.03726 (USD); RoHS: Yes; Number of Pins: 26; Packaging: Bulk; Package Quantity: 1000; Length: 2inch; Cable Pitch: 0.5mm; Radiation Hardening: No; ComponentLink1URL: https://datasheet.ciiva.com/10989/0151660273-cable-10989027.pdf?src-supplier=Avnet; ComponentLink1Description: https://datasheet.ciiva.com/10989/0151660273-cable-10989027.pdf?src-supplier=Avnet; ComponentLink2URL: https://datasheet.ciiva.com/2944/151660051-sd-2944368.pdf?src-supplier=Digi-Key; ComponentLink2Description: https://datasheet.ciiva.com/2944/151660051-sd-2944368.pdf?src-supplier=Digi-Key; Supplier 2: Mouser; Supplier Part Number 1: WM11306-ND; Supplier Part Number 2: 538-15166-0273; Category: Cables and Wire
J2 = 54548-2671: CONN FFC BOTTOM 26POS 0.50MM R/A 26 Position FFC, FPC Connector Contacts, Bottom 0.020" (0.50mm) Surface Mount, Right Angle; Manufacturer_Name: Molex; Actuator Material: Polyphenylene; Current Rating: 500mA; Voltage Rating: 50V; Contact Resistance: 40mR; Number of Positions: 26; Wire/Cable Type: Straight; Pitch: 0.5mm; Datasheet Link: https://www.molex.com/molex/products/datasheet.jsp?part=active/0545482671_FFC_FPC_CONNECTORS.xml&channel=Products&Lang=en-US; Height: 1mm; Manufacturer_Part_Number: 54548-2671; Mouser Part Number: 538-54548-2671; Mouser Price/Stock: https://eu.mouser.com/ProductDetail/Molex/54548-2671?qs=sGAEpiMZZMs7i6cT6ogu49DbkzKdWzYdwOJCTNigfgU%3D; RoHS: Yes; Mount: Surface Mount; Contact Material: Bronze; Contact Plating: Gold; Housing Material: Polymer; Housing Color: Black; Min Operating Temperature: -20°C; Max Operating Temperature: 85°C; Number of Rows: 1; Package Quantity: 750; Packaging: Tape and Reel; Termination: Solder; Number of Contacts: 26; Orientation: Right Angle; Length: 18.2mm; Depth: 5mm; Flammability Rating: UL94 V-0; ComponentLink1URL: https://datasheet.ciiva.com/5137/0545482671-ffc-fpc-connectors-146697-5137857.pdf?src-supplier=Mouser; ComponentLink1Description: https://datasheet.ciiva.com/5137/0545482671-ffc-fpc-connectors-146697-5137857.pdf?src-supplier=Mouser; Supplier 1: Mouser; Manufacturer 1: Molex; Manufacturer Part Number 1: 54548-2671; Stock 1: 6344; Pricing 1: 1=3.03000, 10=2.86000, 25=2.55000, 100=2.42000, 250=2.12000, 500=2.07000 (USD); Supplier 2: Arrow; Manufacturer 2: Molex; Manufacturer Part Number 2: 54548-2671; Stock 2: 11173; Pricing 2: 1=3.50200, 10=3.34800, 25=3.06600, 100=2.78390, 250=2.43800, 500=2.41400, 1000=2.25990, 3000=2.10600, 6000=1.95200, 12000=1.73300, 24000=1.71600, 48000=1.69900, 60000=1.68200 (USD); Supplier Part Number 2: 0545482671; Supplier Part Number 1: 538-54548-2671; System: Connector
R9-R12 = CRCW06030000Z0EA: RES SMD 0 OHM JUMPER 1/10W 0603 0 Ohms Jumper 0.1W, 1/10W Chip Resistor 0603 (1608 Metric) Automotive AEC-Q200 Thick Film; Manufacturer 1: Vishay; Manufacturer Part Number 1: CRCW0603-0000Z0EA; Resistance: 0mR; Power Rating: 100mW; Voltage Rating: 75V; Temperature Coefficient: 100ppm/°C; Tolerance: 5%; Current Rating: 2A; Supplier 1: Digi-Key; Stock 1: 742743; Pricing 1: 1=0.100000, 10=0.034000, 25=0.024400, 50=0.018600, 100=0.013800, 250=0.010480, 500=0.008400, 1000=0.006180 (USD); RoHS: Yes; Mount: Surface Mount; Case/Package: 0603; Weight: 7.1E-05oz; Contact Plating: Tin,Lead; Case Code (Metric): 1608; Case Code (Imperial): 0603; Min Operating Temperature: -55°C; Max Operating Temperature: 155°C; Composition: Thick Film; Termination: SMD/SMT; Packaging: Tape and Reel; Package Quantity: 1; Number of Terminations: 2; Military Standard: Not; Max Power Dissipation: 100mW; Voltage Rating (DC): 75V; Features: Automotive AEC-Q200; Working Voltage: 75V; Length: 1.55mm; Height: 0.02inch; Width: 0.033inch; Depth: 0.85mm; Radiation Hardening: No; Lead Free: Lead Free; REACH SVHC: Unknown; ComponentLink1URL: https://datasheet.ciiva.com/2461/dcrcwe3-2461968.pdf?src-supplier=Digi-Key; ComponentLink1Description: https://datasheet.ciiva.com/2461/dcrcwe3-2461968.pdf?src-supplier=Digi-Key; ComponentLink2URL: https://datasheet.ciiva.com/2461/dcrcwe3-2461969.pdf?src-supplier=Digi-Key; ComponentLink2Description: https://datasheet.ciiva.com/2461/dcrcwe3-2461969.pdf?src-supplier=Digi-Key; ComponentLink3URL: https://datasheet.ciiva.com/2461/dcrcwe3-2461970.pdf?src-supplier=Digi-Key; ComponentLink3Description: https://datasheet.ciiva.com/2461/dcrcwe3-2461970.pdf?src-supplier=Digi-Key; ComponentLink4URL: https://datasheet.ciiva.com/8340/dcrcwe3-8340197.pdf?src-supplier=Avnet; ComponentLink4Description: https://datasheet.ciiva.com/8340/dcrcwe3-8340197.pdf?src-supplier=Avnet; ComponentLink5URL: https://datasheet.ciiva.com/16941/dcrcw-16941302.pdf?src-supplier=Avnet+Europe; ComponentLink5Description: https://datasheet.ciiva.com/16941/dcrcw-16941302.pdf?src-supplier=Avnet+Europe; ComponentLink6URL: https://datasheet.ciiva.com/16199/dcrcwe3-16199063.pdf?src-supplier=Future+Electronics; ComponentLink6Description: https://datasheet.ciiva.com/16199/dcrcwe3-16199063.pdf?src-supplier=Future+Electronics; ComponentLink7URL: https://datasheet.ciiva.com/16725/70201119-16725175.pdf?src-supplier=Allied+Electronics; ComponentLink7Description: https://datasheet.ciiva.com/16725/70201119-16725175.pdf?src-supplier=Allied+Electronics; ComponentLink8URL: https://datasheet.ciiva.com/26316/fld-crcw-e3-data-en-26316615.pdf?src-supplier=Distrelec; ComponentLink8Description: https://datasheet.ciiva.com/26316/fld-crcw-e3-data-en-26316615.pdf?src-supplier=Distrelec; ComponentLink9URL: https://datasheet.ciiva.com/5544/dcrcwe3-109170-5544344.pdf?src-supplier=Mouser; ComponentLink9Description: https://datasheet.ciiva.com/5544/dcrcwe3-109170-5544344.pdf?src-supplier=Mouser; ComponentLink10URL: https://datasheet.ciiva.com/7841/1720486-7841816.pdf?src-supplier=Element14; ComponentLink10Description: https://datasheet.ciiva.com/7841/1720486-7841816.pdf?src-supplier=Element14; ComponentLink11URL: https://datasheet.ciiva.com/7841/1720486-7841817.pdf?src-supplier=Element14; ComponentLink11Description: https://datasheet.ciiva.com/7841/1720486-7841817.pdf?src-supplier=Element14; ComponentLink12URL: https://datasheet.ciiva.com/7841/125364-7841818.pdf?src-supplier=Element14; ComponentLink12Description: https://datasheet.ciiva.com/7841/125364-7841818.pdf?src-supplier=Element14; ComponentLink13URL: https://datasheet.ciiva.com/16721/70201119-16721450.pdf?src-supplier=Allied+Electronics; ComponentLink13Description: https://datasheet.ciiva.com/16721/70201119-16721450.pdf?src-supplier=Allied+Electronics; Supplier Part Number 1: 541-0.0GCT-ND
TP10-TP19 = TEST_POINT

## Sheet RPI_CAM_INTERFACE.SchDoc: =project_title
size Tabloid; PageSetup: Record=PageOptions|CenterHorizontal=True|CenterVertical=True|PrintScale=0.71|XCorrection=1.00|YCorrection=1.00|PrintKind=0|BorderSize=5000000|LeftOffset=0|BottomOffset=0|Orientation=2|PaperLength=1000|PaperWidth=1000|Scale=100|PaperSource=7|PrintQuality=-4|MediaType=1|DitherType=10|PrintScaleMode=1|PaperKind=A4; CompanyName: Luxonis Holding; DrawnBy: Brian Weinstein; Organization: Luxonis Holding; Address1: 1925 Harmony Park Drive; Address2: Westminster, CO; Address3: 80234; Address4: United States; DocumentNumber: D0000999; Revision: R0M0E0; SheetNumber: 3; SheetTotal: 6
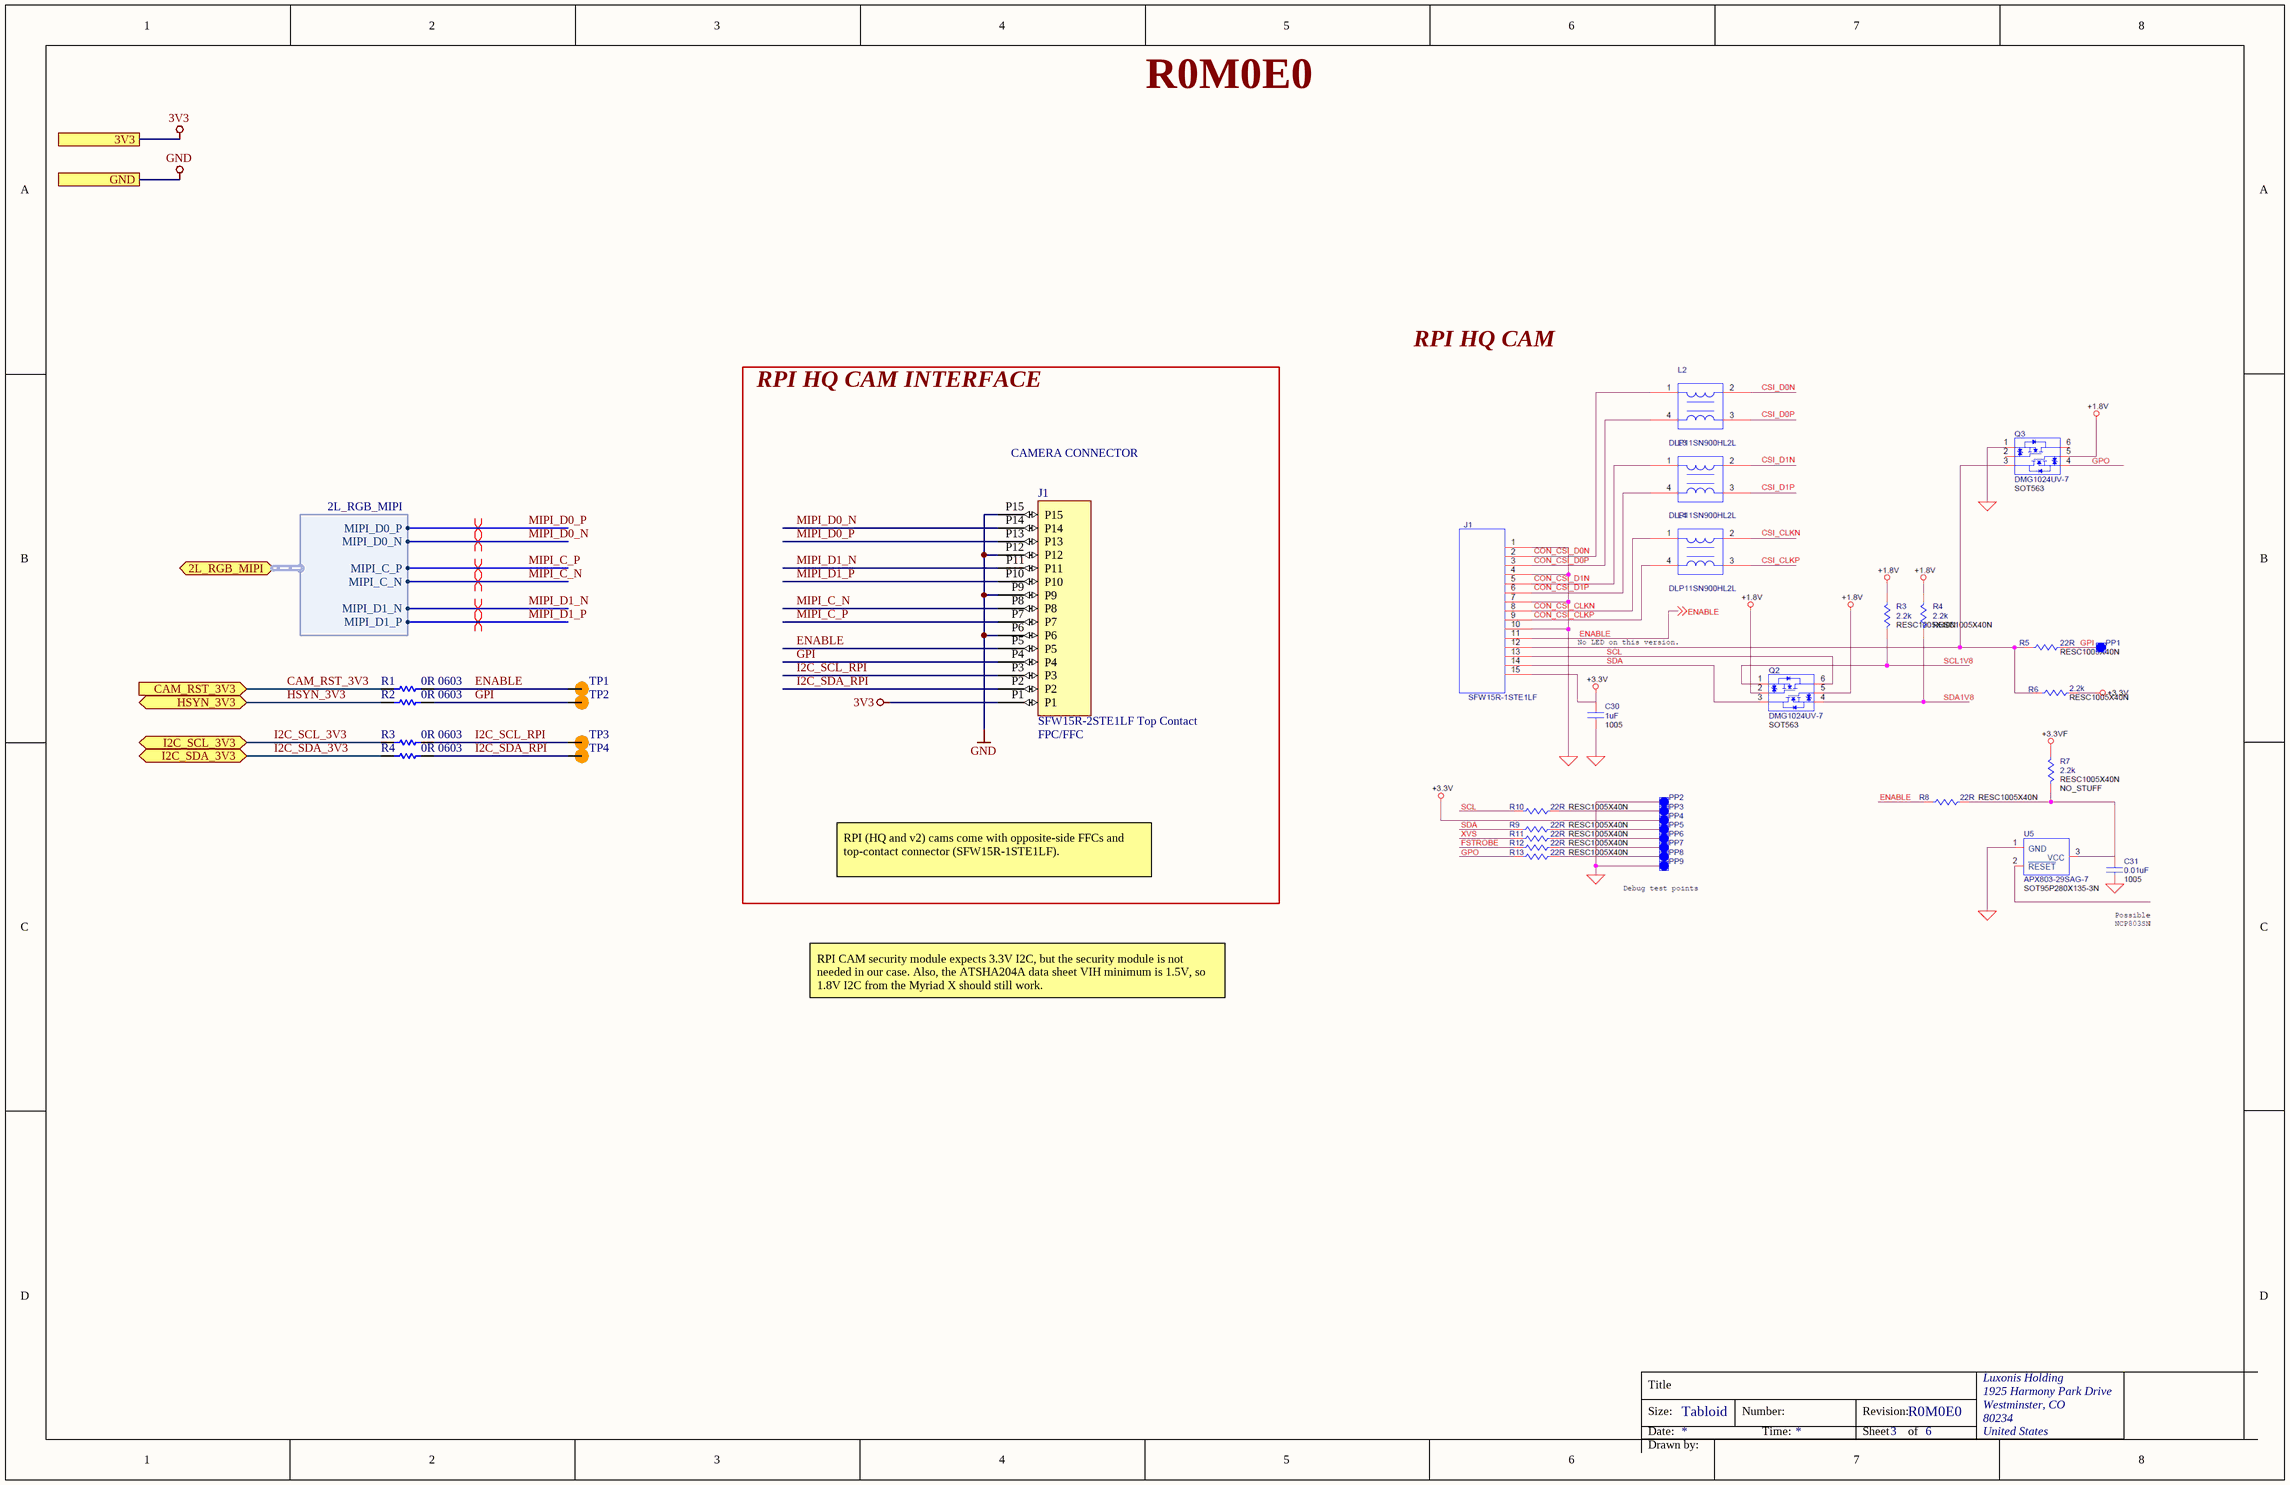
[diagram p5: RPI_CAM_INTERFACE.SchDoc]

### Parts
J1  SFW15R-2STE1LF Top Contact  Component Subtype: FPC/FFC  [SFW15R-2STE1LF]
R1  0R 0603  [RESC0603(1608)_M]
R2  0R 0603  [RESC0603(1608)_M]
R3  0R 0603  [RESC0603(1608)_M]
R4  0R 0603  [RESC0603(1608)_M]
TP1  TP100_150_NS  [TP100_150_NS]  (value not drawn)  (no BOM)
TP2  TP100_150_NS  [TP100_150_NS]  (value not drawn)  (no BOM)
TP3  TP100_150_NS  [TP100_150_NS]  (value not drawn)  (no BOM)
TP4  TP100_150_NS  [TP100_150_NS]  (value not drawn)  (no BOM)

### Blocks framed on the sheet
RPI HQ CAM INTERFACE: J1

### Ports
2L_RGB_MIPI (bidir, harness 2L_RGB_MIPI), 3V3, CAM_RST_3V3 (in), GND, HSYN_3V3 (bidir), I2C_SCL_3V3 (bidir), I2C_SDA_3V3 (bidir)

### Harnesses
2L_RGB_MIPI: MIPI_D0_P, MIPI_D0_N, MIPI_C_P, MIPI_C_N, MIPI_D1_N, MIPI_D1_P

### Nets
3V3: J1.P1 ; port 3V3
GND: J1.P6 J1.P9 J1.P12 J1.P15 ; port GND
CAM_RST_3V3: R1.1 ; port CAM_RST_3V3
ENABLE: J1.P5 R1.2 TP1.1
GPI: J1.P4 R2.2 TP2.1
HSYN_3V3: R2.1 ; port HSYN_3V3
I2C_SCL_3V3: R3.1 ; port I2C_SCL_3V3
I2C_SCL_RPI: J1.P3 R3.2 TP3.1
I2C_SDA_3V3: R4.1 ; port I2C_SDA_3V3
I2C_SDA_RPI: J1.P2 R4.2 TP4.1
MIPI_C_N: J1.P8 ; port 2L_RGB_MIPI.MIPI_C_N
MIPI_C_P: J1.P7 ; port 2L_RGB_MIPI.MIPI_C_P
MIPI_D0_N: J1.P14 ; port 2L_RGB_MIPI.MIPI_D0_N
MIPI_D0_P: J1.P13 ; port 2L_RGB_MIPI.MIPI_D0_P
MIPI_D1_N: J1.P11 ; port 2L_RGB_MIPI.MIPI_D1_N
MIPI_D1_P: J1.P10 ; port 2L_RGB_MIPI.MIPI_D1_P

### Layout directives
differential pair: MIPI_C_N, MIPI_C_P, MIPI_D0_N, MIPI_D0_P, MIPI_D1_N, MIPI_D1_P

### Notes on the sheet
- RPI HQ CAM
- CAMERA CONNECTOR
- RPI (HQ and v2) cams come with opposite-side FFCs and top-contact connector (SFW15R-1STE1LF).
- RPI CAM security module expects 3.3V I2C, but the security module is not needed in our case. Also, the ATSHA204A data sheet VIH minimum is 1.5V, so 1.8V I2C from the Myriad X should still work.
- Title
- Size:
- Date:
- Tabloid
- Number:
- Time:
- Revision:
- Sheet
- of
- Drawn by:

### Library data of the parts
J1 = SFW15R-2STE1LF: CONN FFC FPC TOP 15POS 1MM R/A; Manufacturer: Amphenol; Manufacturer 1: Amphenol FCI; Actuator Material: Glass; Current Rating: 1A; Voltage Rating: 100V; Contact Resistance: 30mR; Number of Positions: 15; Insulation Resistance: 500MR; Wire/Cable Type: Straight; Component Type: Connector; Mount: SMT; Manufacturer PN: SFW15R-2STE1LF; Supplier 1: Digi-Key; Manufacturer Part Number 1: SFW15R-2STE1LF; Stock 1: 4348; Pricing 1: 1=0.51000, 10=0.48200, 25=0.43400, 50=0.38580, 100=0.36960, 250=0.33748, 500=0.32142, 1000=0.26517 (USD); Contact Material: Bronze; Contact Plating: Tin; Housing Color: Brown; Housing Material: Polyphenylene; Min Operating Temperature: -55°C; Max Operating Temperature: 105°C; Packaging: Tape and Reel; Number of Rows: 1; Package Quantity: 2000; Voltage Rating (AC): 100V; Termination: Solder; Contact Location: Top; Number of Contacts: 15; Max Voltage Rating (AC): 100V; Orientation: Right Angle; Length: 20.8mm; Pitch: 1mm; Depth: 6mm; Width: 5.5mm; Lead Free: Lead Free; Flammability Rating: UL94 V-0; ComponentLink1URL: https://datasheet.ciiva.com/670/sfw12lf-670088.pdf?src-supplier=Digi-Key; ComponentLink1Description: https://datasheet.ciiva.com/670/sfw12lf-670088.pdf?src-supplier=Digi-Key; ComponentLink2URL: https://datasheet.ciiva.com/670/sfw12lf-670089.pdf?src-supplier=Digi-Key; ComponentLink2Description: https://datasheet.ciiva.com/670/sfw12lf-670089.pdf?src-supplier=Digi-Key; ComponentLink3URL: https://datasheet.ciiva.com/670/sfw12lf-670090.pdf?src-supplier=Digi-Key; ComponentLink3Description: https://datasheet.ciiva.com/670/sfw12lf-670090.pdf?src-supplier=Digi-Key; ComponentLink4URL: https://datasheet.ciiva.com/5138/sfw12lf-5138988.pdf?src-supplier=Mouser; ComponentLink4Description: https://datasheet.ciiva.com/5138/sfw12lf-5138988.pdf?src-supplier=Mouser; ComponentLink5URL: http://datasheet.octopart.com/SFW15R-2STE1LF-Areva-datasheet-119238.pdf?src-supplier=Mouser; ComponentLink5Description: http://datasheet.octopart.com/SFW15R-2STE1LF-Areva-datasheet-119238.pdf?src-supplier=Mouser; ComponentLink6URL: http://datasheet.octopart.com/SFW15R-2STE1LF-Areva-datasheet-8760026.pdf?src-supplier=_legacy+Avnet; ComponentLink6Description: http://datasheet.octopart.com/SFW15R-2STE1LF-Areva-datasheet-8760026.pdf?src-supplier=_legacy+Avnet; ComponentLink7URL: http://datasheet.octopart.com/SFW15R-2STE1LF-Amphenol-datasheet-94059633.pdf?src-supplier=Newark; ComponentLink7Description: http://datasheet.octopart.com/SFW15R-2STE1LF-Amphenol-datasheet-94059633.pdf?src-supplier=Newark; ComponentLink8URL: http://datasheet.octopart.com/SFW15R-2STE1LF-Amphenol-ICC-datasheet-94059633.pdf?src-supplier=Farnell; ComponentLink8Description: http://datasheet.octopart.com/SFW15R-2STE1LF-Amphenol-ICC-datasheet-94059633.pdf?src-supplier=Farnell; ComponentLink9URL: http://datasheet.octopart.com/SFW15R-2STE1LF-Amphenol-ICC-datasheet-8760026.pdf?src-supplier=Future+Electronics; ComponentLink9Description: http://datasheet.octopart.com/SFW15R-2STE1LF-Amphenol-ICC-datasheet-8760026.pdf?src-supplier=Future+Electronics; Supplier Part Number 1: 609-1906-1-ND; RoHS: Yes; Supplier 2: Digi-Key; Manufacturer 2: Amphenol FCI; Manufacturer Part Number 2: SFW15R-2STE1LF; Stock 2: 4348; Pricing 2: 1=0.51000, 10=0.48200, 25=0.43400, 50=0.38580, 100=0.36960, 250=0.33748, 500=0.32142, 1000=0.26517 (USD); Supplier 3: Mouser; Manufacturer 3: Amphenol FCI; Manufacturer Part Number 3: SFW15R-2STE1LF; Stock 3: 4218; Pricing 3: 1=0.46000, 10=0.35000, 100=0.33600, 500=0.29200, 1000=0.24100, 2000=0.21900, 4000=0.21100, 10000=0.19700, 24000=0.19400 (USD); Supplier Part Number 2: 609-1906-6-ND; Supplier Part Number 3: 649-SFW15R-2STE1LF
R1-R4 = CRCW06030000Z0EA: as R9 on sheet DEPTHAI_CAM_INTERFACE; Supplier 1: Digi-Key; Stock 1: 742743; Pricing 1: 1=0.100000, 10=0.034000, 25=0.024400, 50=0.018600, 100=0.013800, 250=0.010480, 500=0.008400, 1000=0.006180 (USD); RoHS: Yes; Mount: Surface Mount; Case/Package: 0603; Weight: 7.1E-05oz; Contact Plating: Tin,Lead; Case Code (Metric): 1608; Case Code (Imperial): 0603; Min Operating Temperature: -55°C; Max Operating Temperature: 155°C; Composition: Thick Film; Termination: SMD/SMT; Packaging: Tape and Reel; Package Quantity: 1; Number of Terminations: 2; Military Standard: Not; Max Power Dissipation: 100mW; Voltage Rating (DC): 75V; Features: Automotive AEC-Q200; Working Voltage: 75V; Length: 1.55mm; Height: 0.02inch; Width: 0.033inch; Depth: 0.85mm; Radiation Hardening: No; Lead Free: Lead Free; REACH SVHC: Unknown; ComponentLink1URL: https://datasheet.ciiva.com/2461/dcrcwe3-2461968.pdf?src-supplier=Digi-Key; ComponentLink1Description: https://datasheet.ciiva.com/2461/dcrcwe3-2461968.pdf?src-supplier=Digi-Key; ComponentLink2URL: https://datasheet.ciiva.com/2461/dcrcwe3-2461969.pdf?src-supplier=Digi-Key; ComponentLink2Description: https://datasheet.ciiva.com/2461/dcrcwe3-2461969.pdf?src-supplier=Digi-Key; ComponentLink3URL: https://datasheet.ciiva.com/2461/dcrcwe3-2461970.pdf?src-supplier=Digi-Key; ComponentLink3Description: https://datasheet.ciiva.com/2461/dcrcwe3-2461970.pdf?src-supplier=Digi-Key; ComponentLink4URL: https://datasheet.ciiva.com/8340/dcrcwe3-8340197.pdf?src-supplier=Avnet; ComponentLink4Description: https://datasheet.ciiva.com/8340/dcrcwe3-8340197.pdf?src-supplier=Avnet; ComponentLink5URL: https://datasheet.ciiva.com/16941/dcrcw-16941302.pdf?src-supplier=Avnet+Europe; ComponentLink5Description: https://datasheet.ciiva.com/16941/dcrcw-16941302.pdf?src-supplier=Avnet+Europe; ComponentLink6URL: https://datasheet.ciiva.com/16199/dcrcwe3-16199063.pdf?src-supplier=Future+Electronics; ComponentLink6Description: https://datasheet.ciiva.com/16199/dcrcwe3-16199063.pdf?src-supplier=Future+Electronics; ComponentLink7URL: https://datasheet.ciiva.com/16725/70201119-16725175.pdf?src-supplier=Allied+Electronics; ComponentLink7Description: https://datasheet.ciiva.com/16725/70201119-16725175.pdf?src-supplier=Allied+Electronics; ComponentLink8URL: https://datasheet.ciiva.com/26316/fld-crcw-e3-data-en-26316615.pdf?src-supplier=Distrelec; ComponentLink8Description: https://datasheet.ciiva.com/26316/fld-crcw-e3-data-en-26316615.pdf?src-supplier=Distrelec; ComponentLink9URL: https://datasheet.ciiva.com/5544/dcrcwe3-109170-5544344.pdf?src-supplier=Mouser; ComponentLink9Description: https://datasheet.ciiva.com/5544/dcrcwe3-109170-5544344.pdf?src-supplier=Mouser; ComponentLink10URL: https://datasheet.ciiva.com/7841/1720486-7841816.pdf?src-supplier=Element14; ComponentLink10Description: https://datasheet.ciiva.com/7841/1720486-7841816.pdf?src-supplier=Element14; ComponentLink11URL: https://datasheet.ciiva.com/7841/1720486-7841817.pdf?src-supplier=Element14; ComponentLink11Description: https://datasheet.ciiva.com/7841/1720486-7841817.pdf?src-supplier=Element14; ComponentLink12URL: https://datasheet.ciiva.com/7841/125364-7841818.pdf?src-supplier=Element14; ComponentLink12Description: https://datasheet.ciiva.com/7841/125364-7841818.pdf?src-supplier=Element14; ComponentLink13URL: https://datasheet.ciiva.com/16721/70201119-16721450.pdf?src-supplier=Allied+Electronics; ComponentLink13Description: https://datasheet.ciiva.com/16721/70201119-16721450.pdf?src-supplier=Allied+Electronics; Supplier Part Number 1: 541-0.0GCT-ND
TP1-TP4 = TEST_POINT